# EAGLE design DIDV_-_Controle_Corrente_Total (EAGLE 6.2)

## Sheet 1 of 5
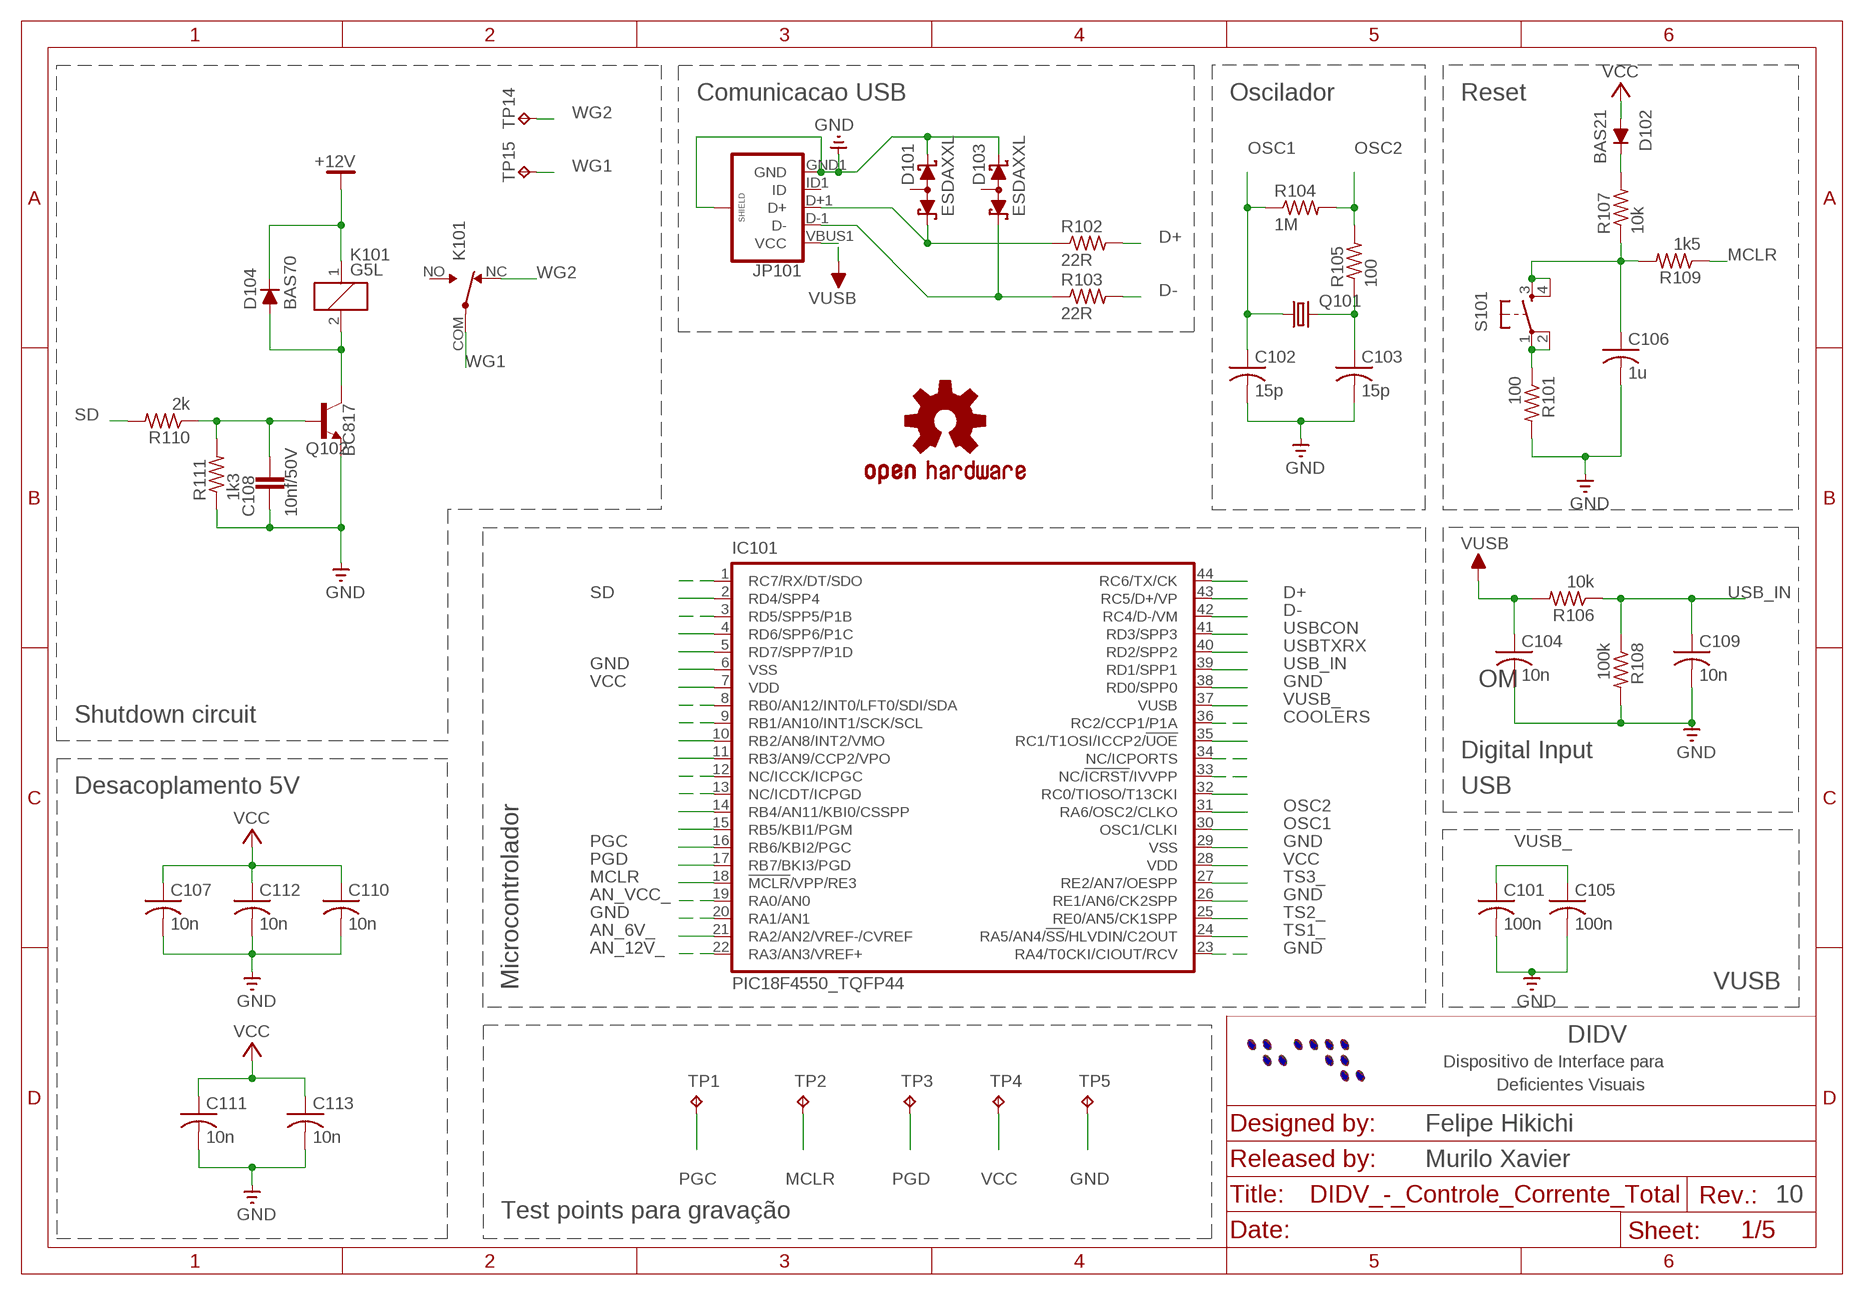
[diagram p0: schematic, sheet 1]

### Parts
C101  100n  C-USC0603  [C0603]
C102  15p  C-USC0603K  [C0603K]
C103  15p  C-USC0603K  [C0603K]
C104  10n  C-USC0805K  [C0805K]
C105  100n  C-USC0603  [C0603]
C106  1u  C-USC0805K  [C0805K]
C107  10n  C-USC0603  [C0603]
C108  10nf/50V  C-EUC0603K  [C0603K]
C109  10n  C-USC0603K  [C0603K]
C110  10n  C-USC0805K  [C0805K]
C111  10n  C-USC0805K  [C0805K]
C112  10n  C-USC0603  [C0603]
C113  10n  C-USC0805K  [C0805K]
D101  ESDAXXL  [SOT23]
D102  BAS21  BAS19  [SOT23]
D103  ESDAXXL  [SOT23]
D104  BAS70  BAS40  [SOT23]
IC101  PIC18F4550_TQFP44  PIC18F4550_TQFP  [TQFP44]
JP101  USB_MICROB_PLUGCONN-11752  [USB-B-MICRO-SMD_V03]
K101  G5L  [G5LE]
LOGO101  OSHW-LOGOL  [OSHW-LOGO-L]
Q101  CRYSTALSM49  [SM49]
Q102  BC817  BC817-16LT1SMD  [SOT23-BEC]
R101  100  R-US_R0603  [R0603]
R102  22R  R-US_R0603  [R0603]
R103  22R  R-US_R0603  [R0603]
R104  1M  R-US_R0603  [R0603]
R105  100  R-US_R0603  [R0603]
R106  10k  R-US_R0603  [R0603]
R107  10k  R-US_R0603  [R0603]
R108  100k  R-US_R0603  [R0603]
R109  1k5  R-US_R0603  [R0603]
R110  2k  R-US_R0603  [R0603]
R111  1k3  R-US_R0603  [R0603]
S101  TAC_SWITCHPTH  [TACTILE-PTH]
TP1  TPB1,27  [B1,27]
TP2  TPB1,27  [B1,27]
TP3  TPB1,27  [B1,27]
TP4  TPB1,27  [B1,27]
TP5  TPB1,27  [B1,27]
TP14  TP-063  [TP-063]
TP15  TP-063  [TP-063]

### Nets
+12V: D104.3(C) K101.1 ; also sheet 2,3,5
AN_6V_: IC101.21(RA2/AN2/VREF-/CVREF) ; also sheet 3
AN_12V_: IC101.22(RA3/AN3/VREF+) ; also sheet 3
AN_VCC_: IC101.19(RA0/AN0) ; also sheet 3
COOLERS: IC101.36(RC2/CCP1/P1A) ; also sheet 5
D+: IC101.43(RC5/D+/VP) R102.2
D-: IC101.42(RC4/D-/VM) R103.2
GND: C101.2 C102.2 C103.2 C104.2 C105.2 C106.2 C107.2 C108.2 C109.2 C110.2 C111.2 C112.2 C113.2 D101.2(C2) D103.2(C2) IC101.6(VSS) IC101.20(RA1/AN1) IC101.23(RA4/T0CKI/CIOUT/RCV) IC101.26(RE1/AN6/CK2SPP) IC101.29(VSS) IC101.38(RD0/SPP0) JP101.GND1(GND) JP101.SHIELD1(SHIELD) JP101.SHIELD2(SHIELD) JP101.SHIELD3(SHIELD) Q102.E R101.2 R108.2 R111.1 TP5.TP ; also sheet 2,3,4,5
MCLR: IC101.18(!MCLR!/VPP/RE3) R109.1 TP2.TP
N$3: C103.1 Q101.2 R105.1
N$11: D102.3(C) R107.2
N$16: IC101.4(RD6/SPP6/P1C)
N$17: IC101.14(RB4/AN11/KBI0/CSSPP)
N$18: IC101.15(RB5/KBI1/PGM)
N$19: IC101.35(RC1/T1OSI/ICCP2/!UOE)
N$22: IC101.44(RC6/TX/CK)
N$23: IC101.32(RC0/TIOSO/T13CKI)
N$24: IC101.11(RB3/AN9/CCP2/VPO)
N$26: IC101.5(RD7/SPP7/P1D)
N$28: D104.1(A) K101.2 Q102.C
N$29: C108.1 Q102.B R110.1 R111.2
N$33: D103.1(C1) JP101.D-1(D-) R103.1
N$35: IC101.13(NC/ICDT/ICPGD)
N$36: IC101.12(NC/ICCK/ICPGC)
N$37: D101.1(C1) JP101.D+1(D+) R102.1
N$38: IC101.9(RB1/AN10/INT1/SCK/SCL)
N$39: IC101.8(RB0/AN12/INT0/LFT0/SDI/SDA)
N$40: IC101.3(RD5/SPP5/P1B)
N$41: IC101.1(RC7/RX/DT/SDO)
N$43: IC101.34(NC/ICPORTS)
N$44: IC101.33(NC/!ICRST!/IVVPP)
N$45: R101.1 S101.1 S101.2
N$68: IC101.10(RB2/AN8/INT2/VMO)
OSC1: C102.1 IC101.30(OSC1/CLKI) Q101.1 R104.1
OSC2: IC101.31(RA6/OSC2/CLKO) R104.2 R105.2
PGC: IC101.16(RB6/KBI2/PGC) TP1.TP
PGD: IC101.17(RB7/BKI3/PGD) TP3.TP
SD: IC101.2(RD4/SPP4) R110.2
TS1_: IC101.24(RA5/AN4/!SS!/HLVDIN/C2OUT) ; also sheet 4
TS2_: IC101.25(RE0/AN5/CK1SPP) ; also sheet 4
TS3_: IC101.27(RE2/AN7/OESPP) ; also sheet 4
U_MCLR: C106.1 R107.1 R109.2 S101.3 S101.4
USB_IN: C109.1 IC101.39(RD1/SPP1) R106.1 R108.1
USBCON: IC101.41(RD3/SPP3) ; also sheet 2
USBTXRX: IC101.40(RD2/SPP2) ; also sheet 2
VCC: C107.1 C110.1 C111.1 C112.1 C113.1 D102.1(A) IC101.7(VDD) IC101.28(VDD) TP4.TP ; also sheet 2,3,4
VUSB: C104.1 JP101.VBUS1(VCC) R106.2
VUSB_: C101.1 C105.1 IC101.37(VUSB)
WG1: K101.COM(-A:COM) TP15.1
WG2: K101.NC(-A:NC) TP14.1
Unconnected: D101.3(A) D103.3(A) JP101.ID1(ID) K101.NO(-A:NO)

### Notes on the sheet
- Comunicacao USB | Oscilador | Reset
- OM
- Shutdown circuit
- Digital Input
- Desacoplamento 5V | USB
- VUSB
- Microcontrolador
- DIDV
- Dispositivo de Interface para
- Deficientes Visuais
- Felipe Hikichi
- Murilo Xavier
- 10
- Test points para gravação

## Sheet 2 of 5
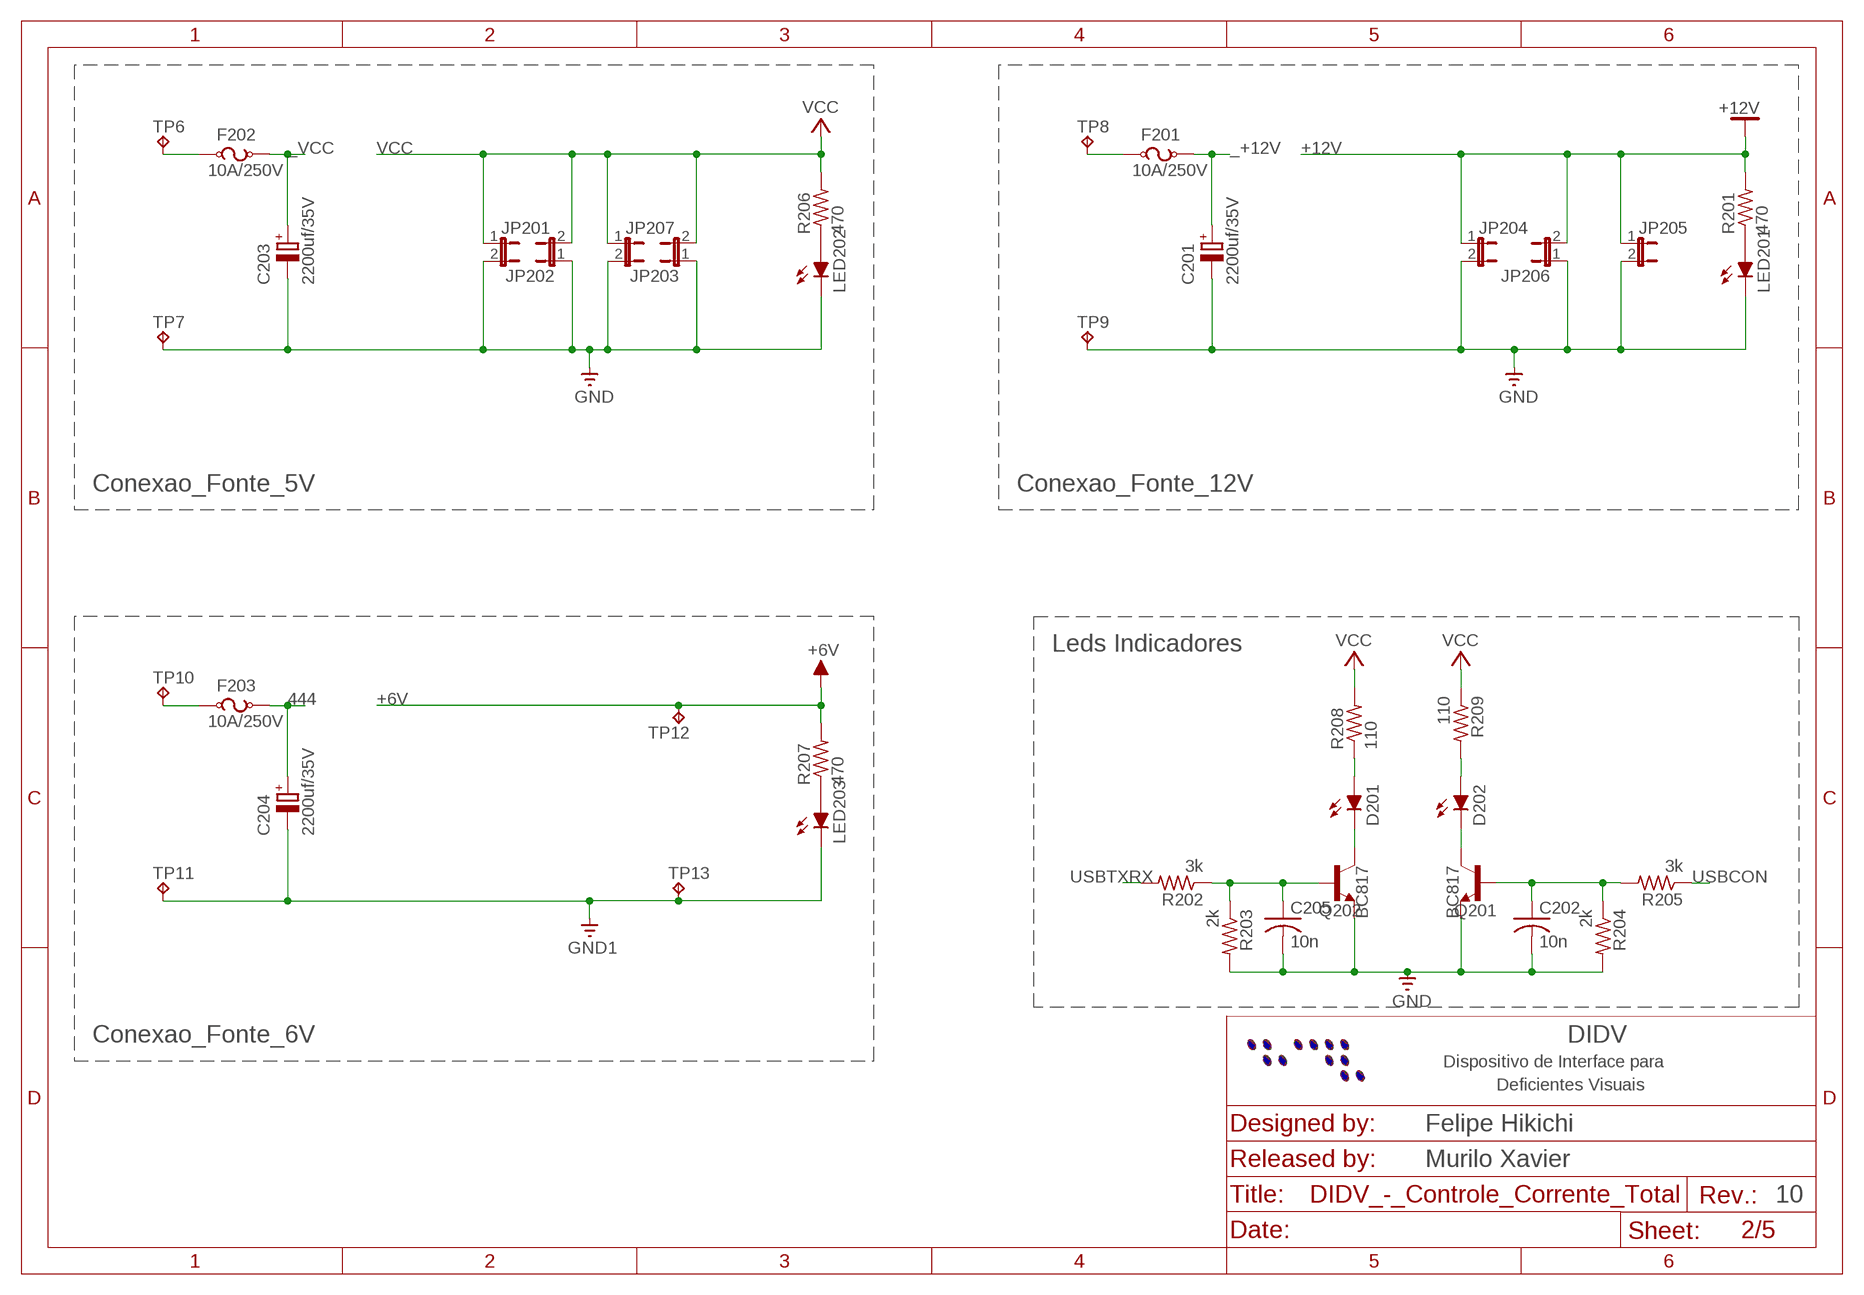
[diagram p1: schematic, sheet 2]

### Parts
C201  2200uf/35V  CPOL-EUE3.5-10  [E3,5-10]
C202  10n  C-USC0603  [C0603]
C203  2200uf/35V  CPOL-EUE3.5-10  [E3,5-10]
C204  2200uf/35V  CPOL-EUE3.5-10  [E3,5-10]
C205  10n  C-USC0603  [C0603]
D201  LEDTOPLED-SANTANA  [MINI-TOPLED-SANTANA]
D202  LEDTOPLED-SANTANA  [MINI-TOPLED-SANTANA]
F201  10A/250V  KS9V  [KS9V]
F202  10A/250V  KS9V  [KS9V]
F203  10A/250V  KS9V  [KS9V]
JP201  JP1EY  [JP1Y]
JP202  JP1EY  [JP1Y]
JP203  JP1EY  [JP1Y]
JP204  JP1EY  [JP1Y]
JP205  JP1EY  [JP1Y]
JP206  JP1EY  [JP1Y]
JP207  JP1EY  [JP1Y]
LED201  LEDP-LCC-2  [P-LCC-2]
LED202  LEDP-LCC-2  [P-LCC-2]
LED203  LEDP-LCC-2  [P-LCC-2]
Q201  BC817  BC817-16LT1SMD  [SOT23-BEC]
Q202  BC817  BC817-16LT1SMD  [SOT23-BEC]
R201  470  R-US_R1206  [R1206]
R202  3k  R-US_R0603  [R0603]
R203  2k  R-US_R0603  [R0603]
R204  2k  R-US_R0603  [R0603]
R205  3k  R-US_R0603  [R0603]
R206  470  R-US_R1206  [R1206]
R207  470  R-US_R1206  [R1206]
R208  110  R-US_R1206  [R1206]
R209  110  R-US_R1206  [R1206]
TP6  TP-063  [TP-063]
TP7  TP-063  [TP-063]
TP8  TP-063  [TP-063]
TP9  TP-063  [TP-063]
TP10  TP-063  [TP-063]
TP11  TP-063  [TP-063]
TP12  TP-063  [TP-063]
TP13  TP-063  [TP-063]

### Nets
444: C204.+ F203.2 ; also sheet 3
+6V: R207.2 TP12.1 ; also sheet 3
+12V: JP204.1 JP205.1 JP206.2 R201.2 ; also sheet 1,3,5
_+12V: C201.+ F201.2 ; also sheet 3
_VCC: C203.+ F202.2 ; also sheet 3
GND: C201.- C202.2 C203.- C205.2 JP201.2 JP202.1 JP203.1 JP204.2 JP205.2 JP206.1 JP207.2 LED201.C LED202.C Q201.E Q202.E R203.2 R204.2 TP7.1 TP9.1 ; also sheet 1,3,4,5
GND1: C204.- LED203.C TP11.1 TP13.1
N$1: LED202.A R206.1
N$4: LED201.A R201.1
N$5: F201.1 TP8.1
N$7: LED203.A R207.1
N$8: F203.1 TP10.1
N$9: D201.A R208.1
N$10: D202.A R209.2
N$13: C205.1 Q202.B R202.1 R203.1
N$15: C202.1 Q201.B R204.1 R205.2
N$30: D201.C Q202.C
N$31: D202.C Q201.C
N$46: F202.1 TP6.1
USBCON: R205.1 ; also sheet 1
USBTXRX: R202.2 ; also sheet 1
VCC: JP201.1 JP202.2 JP203.2 JP207.1 R206.2 R208.2 R209.1 ; also sheet 1,3,4

### Notes on the sheet
- Conexao_Fonte_5V | Conexao_Fonte_12V
- Leds Indicadores
- Conexao_Fonte_6V | DIDV
- Dispositivo de Interface para
- Deficientes Visuais
- Felipe Hikichi
- Murilo Xavier
- 10

## Sheet 3 of 5
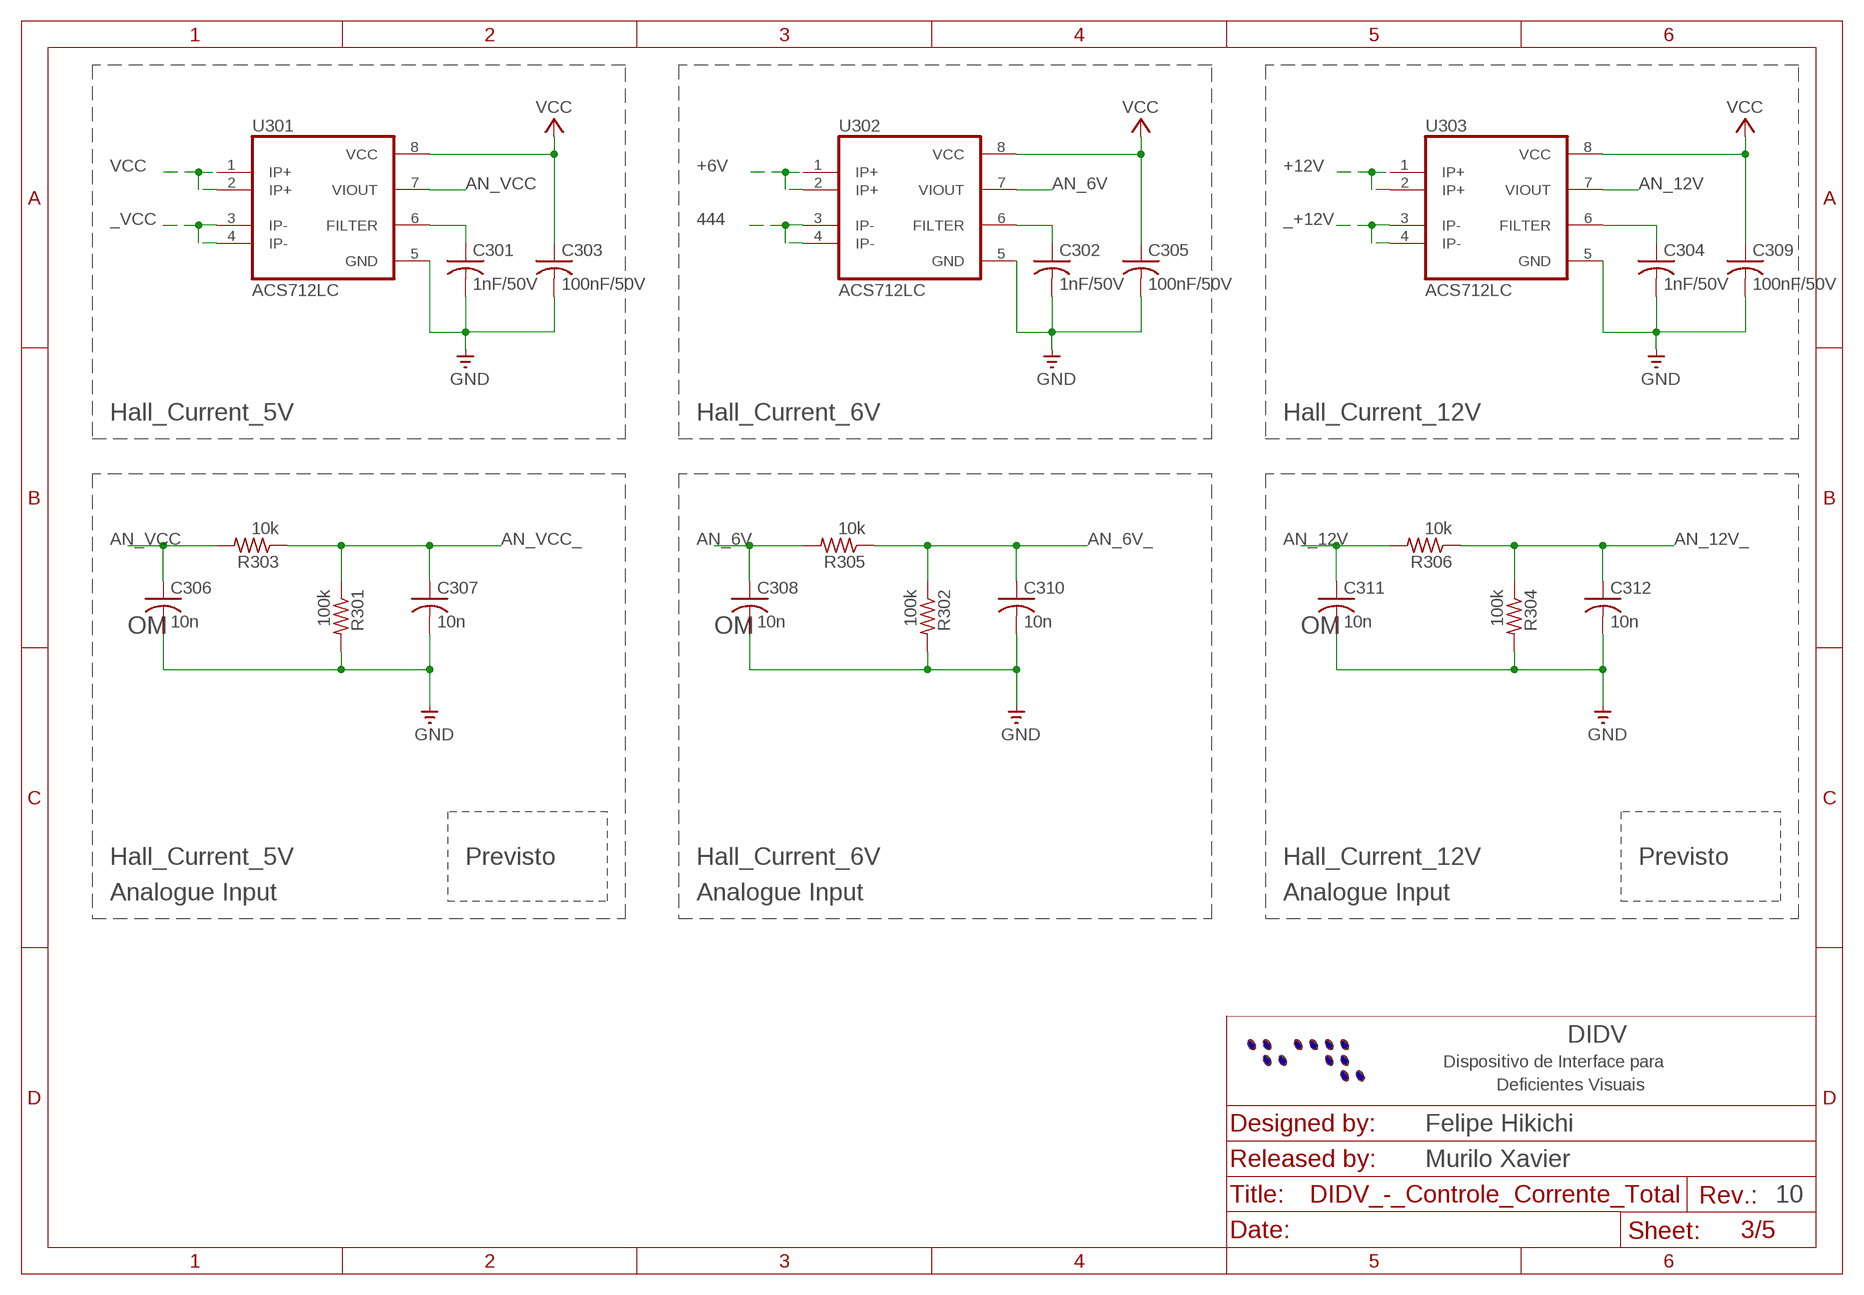
[diagram p2: schematic, sheet 3]

### Parts
C301  1nF/50V  C-USC0603  [C0603]
C302  1nF/50V  C-USC0603  [C0603]
C303  100nF/50V  C-USC0805  [C0805]
C304  1nF/50V  C-USC0603  [C0603]
C305  100nF/50V  C-USC0805  [C0805]
C306  10n  C-USC0805K  [C0805K]
C307  10n  C-USC0603K  [C0603K]
C308  10n  C-USC0805K  [C0805K]
C309  100nF/50V  C-USC0805  [C0805]
C310  10n  C-USC0603K  [C0603K]
C311  10n  C-USC0805K  [C0805K]
C312  10n  C-USC0603K  [C0603K]
R301  100k  R-US_R0603  [R0603]
R302  100k  R-US_R0603  [R0603]
R303  10k  R-US_R0603  [R0603]
R304  100k  R-US_R0603  [R0603]
R305  10k  R-US_R0603  [R0603]
R306  10k  R-US_R0603  [R0603]
U301  ACS712LC  [SO08]
U302  ACS712LC  [SO08]
U303  ACS712LC  [SO08]

### Nets
444: U302.3(IP-) U302.4(IP-) ; also sheet 2
+6V: U302.1(IP+) U302.2(IP+) ; also sheet 2
+12V: U303.1(IP+) U303.2(IP+) ; also sheet 1,2,5
_+12V: U303.3(IP-) U303.4(IP-) ; also sheet 2
_VCC: U301.3(IP-) U301.4(IP-) ; also sheet 2
AN_6V: C308.1 R305.2 U302.7(VIOUT)
AN_6V_: C310.1 R302.1 R305.1 ; also sheet 1
AN_12V: C311.1 R306.2 U303.7(VIOUT)
AN_12V_: C312.1 R304.1 R306.1 ; also sheet 1
AN_VCC: C306.1 R303.2 U301.7(VIOUT)
AN_VCC_: C307.1 R301.1 R303.1 ; also sheet 1
GND: C301.2 C302.2 C303.2 C304.2 C305.2 C306.2 C307.2 C308.2 C309.2 C310.2 C311.2 C312.2 R301.2 R302.2 R304.2 U301.5(GND) U302.5(GND) U303.5(GND) ; also sheet 1,2,4,5
N$2: C302.1 U302.6(FILTER)
N$6: C304.1 U303.6(FILTER)
N$12: C301.1 U301.6(FILTER)
VCC: C303.1 C305.1 C309.1 U301.1(IP+) U301.2(IP+) U301.8(VCC) U302.8(VCC) U303.8(VCC) ; also sheet 1,2,4

### Notes on the sheet
- Hall_Current_5V | Hall_Current_6V | Hall_Current_12V
- OM | OM | OM
- Hall_Current_5V | Previsto | Hall_Current_6V | Hall_Current_12V | Previsto
- Analogue Input | Analogue Input | Analogue Input
- DIDV
- Dispositivo de Interface para
- Deficientes Visuais
- Felipe Hikichi
- Murilo Xavier
- 10

## Sheet 4 of 5
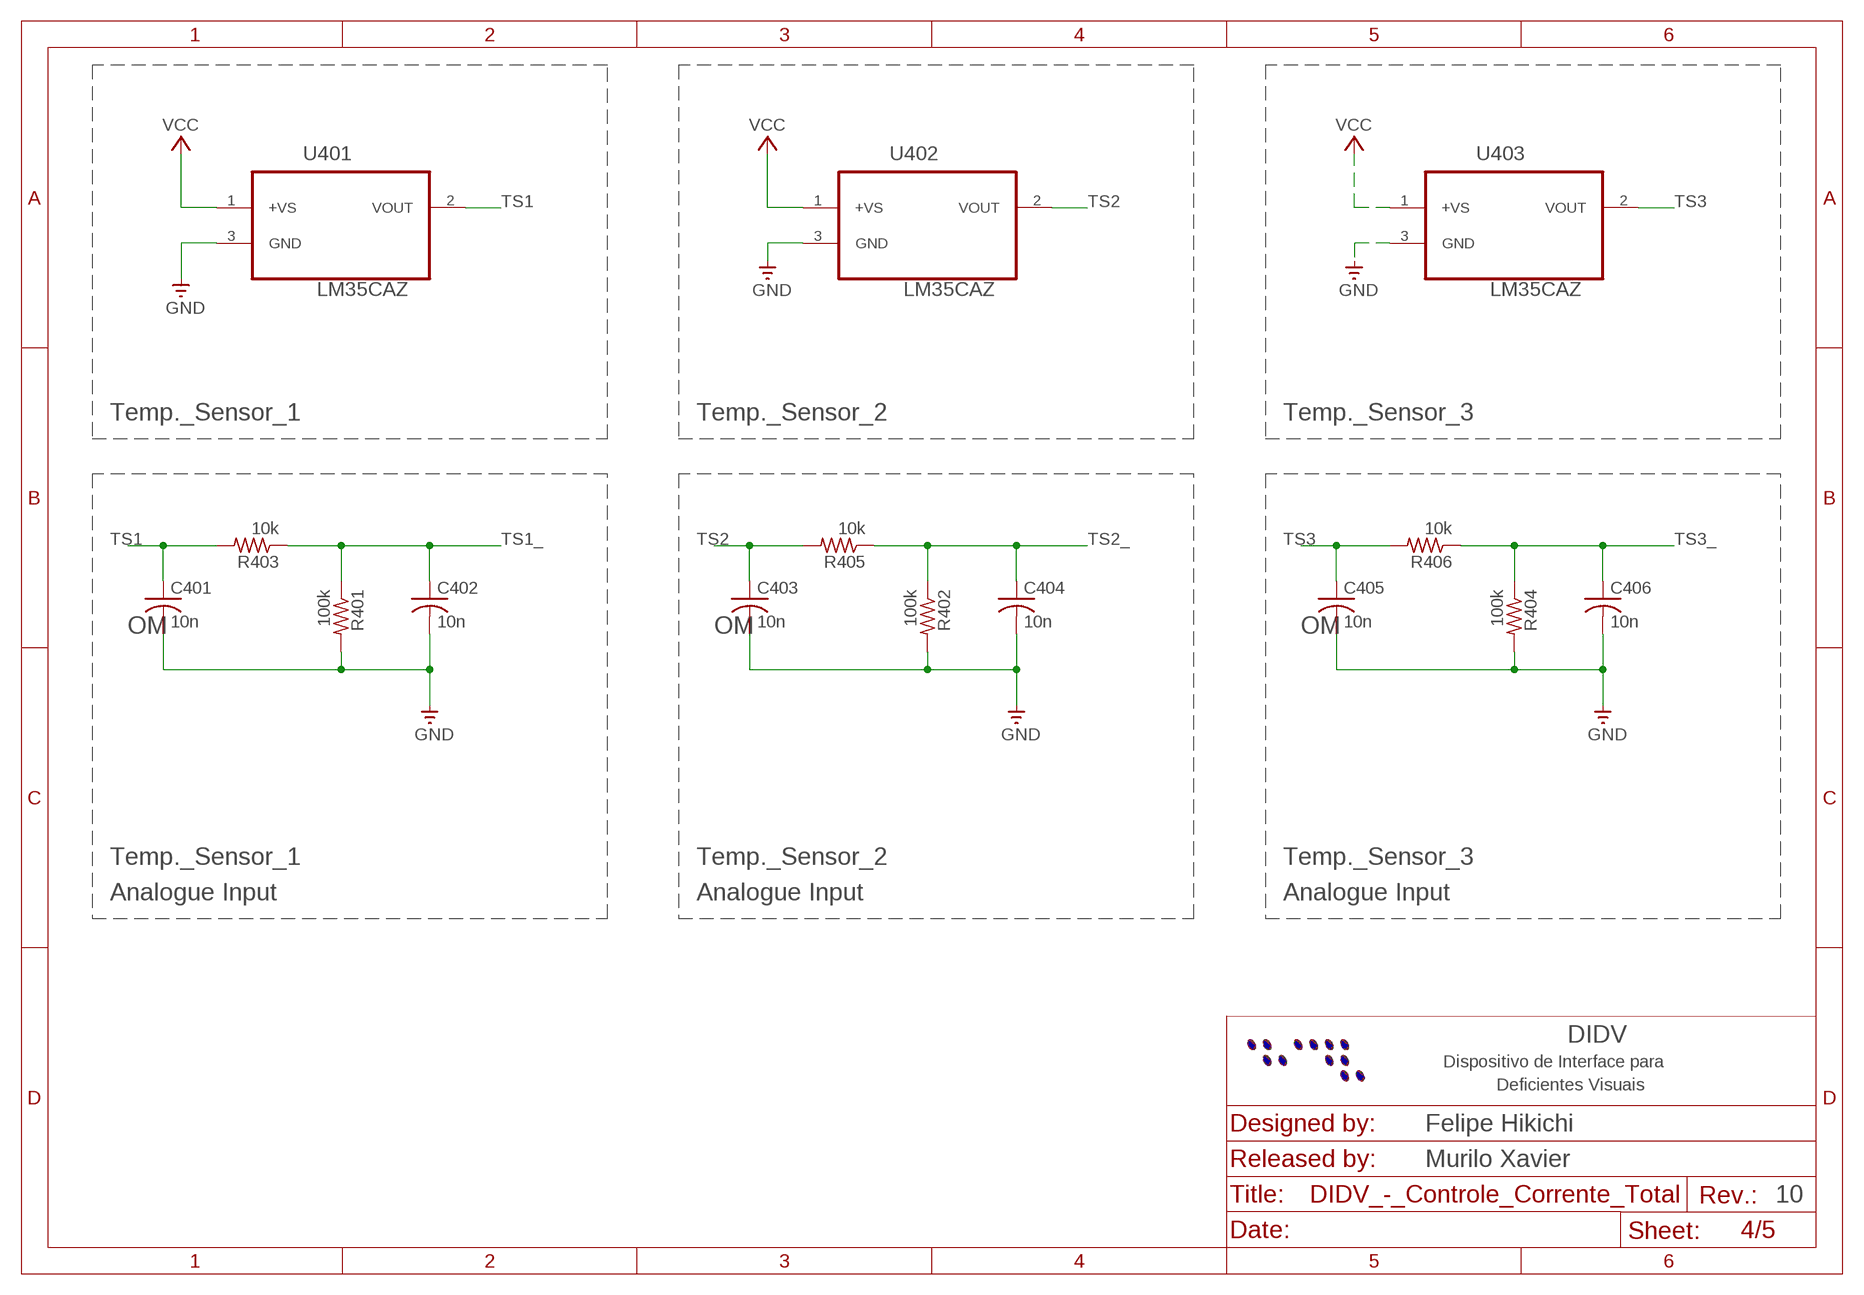
[diagram p3: schematic, sheet 4]

### Parts
C401  10n  C-USC0805K  [C0805K]
C402  10n  C-USC0603K  [C0603K]
C403  10n  C-USC0805K  [C0805K]
C404  10n  C-USC0603K  [C0603K]
C405  10n  C-USC0805K  [C0805K]
C406  10n  C-USC0603K  [C0603K]
R401  100k  R-US_R0603  [R0603]
R402  100k  R-US_R0603  [R0603]
R403  10k  R-US_R0603  [R0603]
R404  100k  R-US_R0603  [R0603]
R405  10k  R-US_R0603  [R0603]
R406  10k  R-US_R0603  [R0603]
U401  LM35CAZ  [TO127P254X495-3P]
U402  LM35CAZ  [TO127P254X495-3P]
U403  LM35CAZ  [TO127P254X495-3P]

### Nets
GND: C401.2 C402.2 C403.2 C404.2 C405.2 C406.2 R401.2 R402.2 R404.2 U401.3(GND) U402.3(GND) U403.3(GND) ; also sheet 1,2,3,5
TS1: C401.1 R403.2 U401.2(VOUT)
TS1_: C402.1 R401.1 R403.1 ; also sheet 1
TS2: C403.1 R405.2 U402.2(VOUT)
TS2_: C404.1 R402.1 R405.1 ; also sheet 1
TS3: C405.1 R406.2 U403.2(VOUT)
TS3_: C406.1 R404.1 R406.1 ; also sheet 1
VCC: U401.1(+VS) U402.1(+VS) U403.1(+VS) ; also sheet 1,2,3

### Notes on the sheet
- Temp._Sensor_1 | Temp._Sensor_2 | Temp._Sensor_3
- OM | OM | OM
- Temp._Sensor_1 | Temp._Sensor_2 | Temp._Sensor_3
- Analogue Input | Analogue Input | Analogue Input
- DIDV
- Dispositivo de Interface para
- Deficientes Visuais
- Felipe Hikichi
- Murilo Xavier
- 10

## Sheet 5 of 5
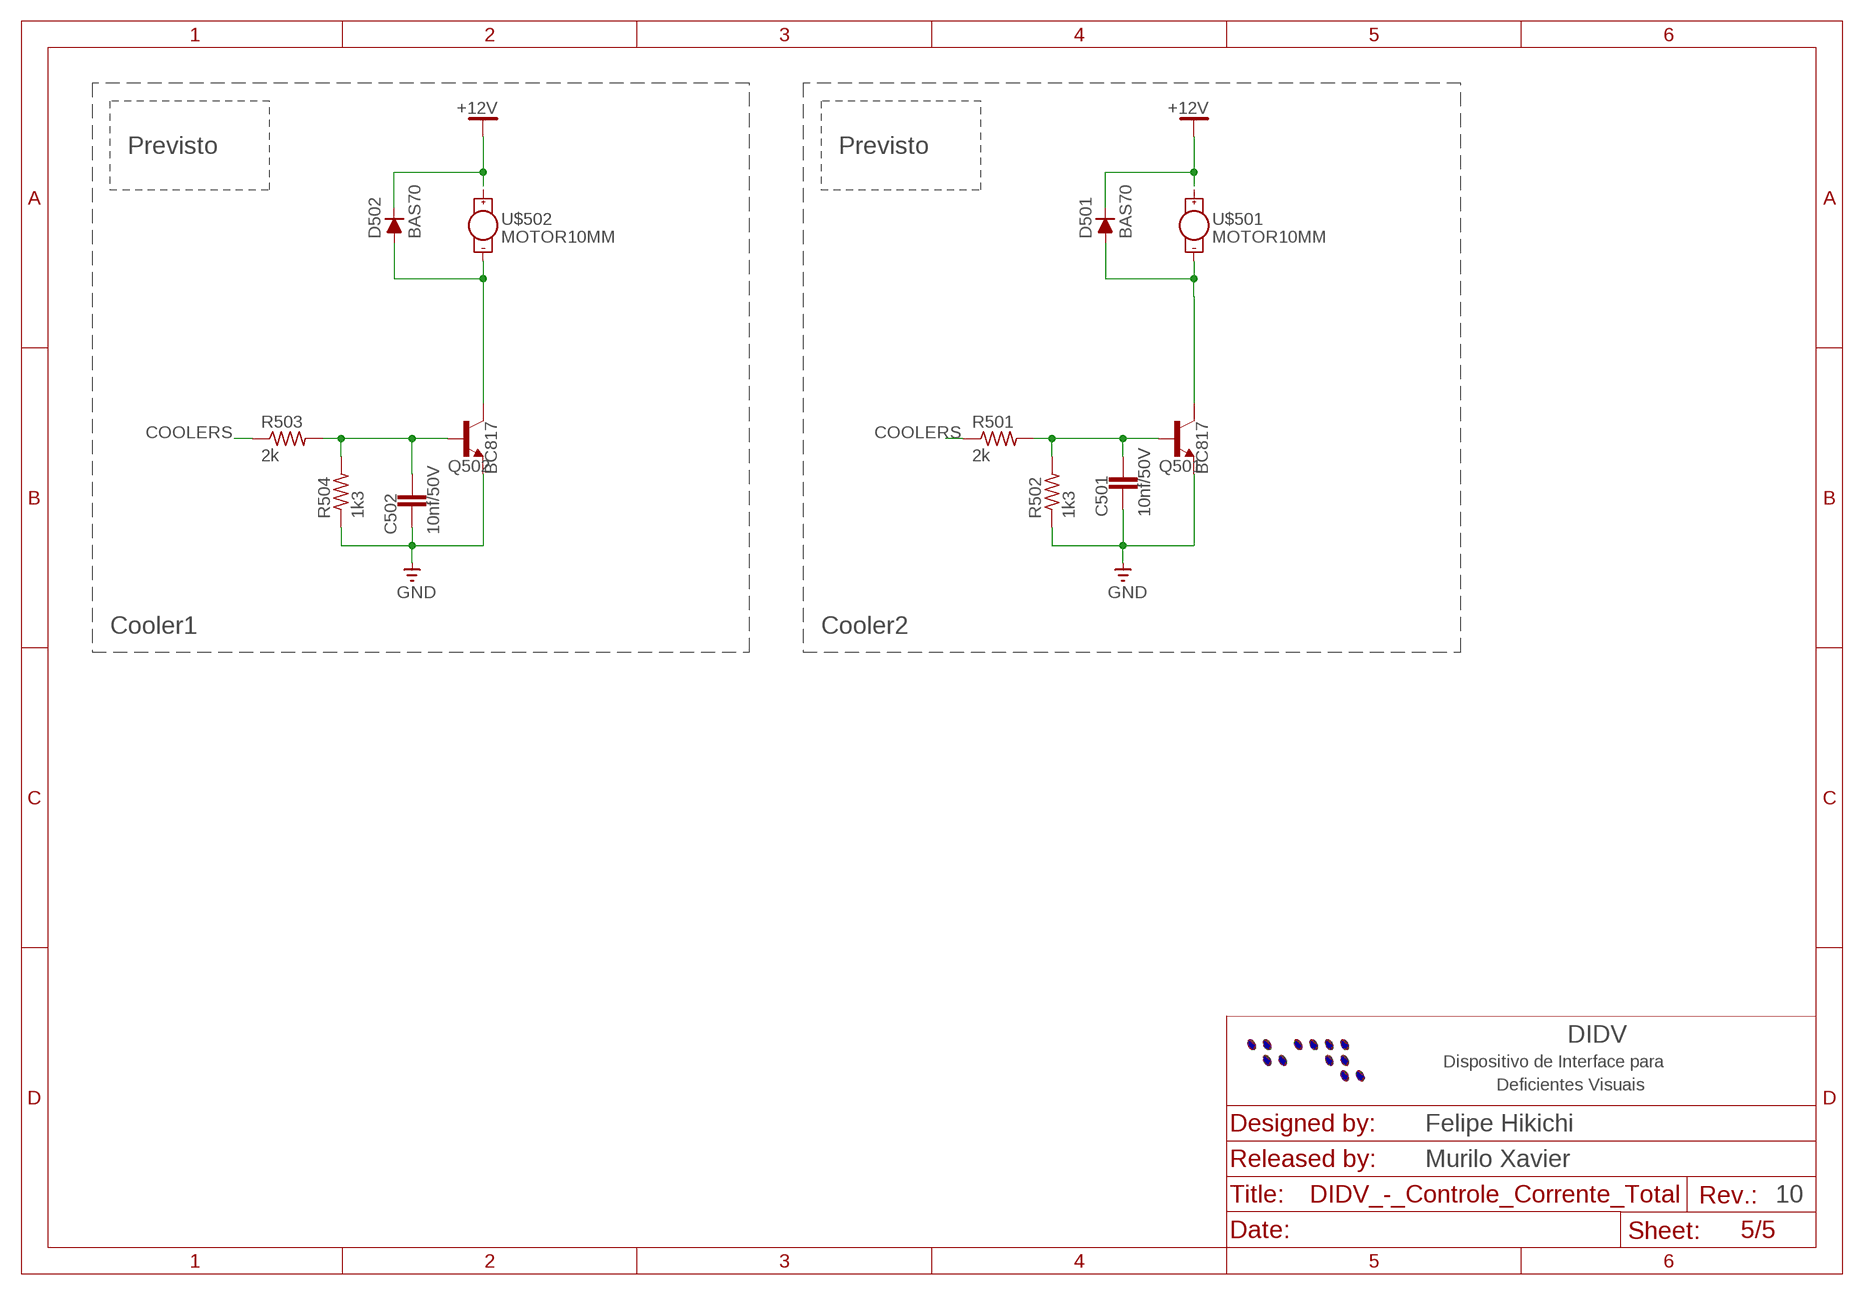
[diagram p4: schematic, sheet 5]

### Parts
C501  10nf/50V  C-EUC0603K  [C0603K]
C502  10nf/50V  C-EUC0603K  [C0603K]
D501  BAS70  BAS40  [SOT23]
D502  BAS70  BAS40  [SOT23]
Q501  BC817  BC817-16LT1SMD  [SOT23-BEC]
Q502  BC817  BC817-16LT1SMD  [SOT23-BEC]
R501  2k  R-US_R0603  [R0603]
R502  1k3  R-US_R0603  [R0603]
R503  2k  R-US_R0603  [R0603]
R504  1k3  R-US_R0603  [R0603]
U$501  MOTOR10MM  [VIBE-MOTOR-10MM]
U$502  MOTOR10MM  [VIBE-MOTOR-10MM]

### Nets
+12V: D501.3(C) D502.3(C) U$501.+ U$502.+ ; also sheet 1,2,3
COOLERS: R501.1 R503.1 ; also sheet 1
GND: C501.2 C502.2 Q501.E Q502.E R502.1 R504.1 ; also sheet 1,2,3,4
N$14: C501.1 Q501.B R501.2 R502.2
N$21: D501.1(A) Q501.C U$501.-
N$70: C502.1 Q502.B R503.2 R504.2
N$71: D502.1(A) Q502.C U$502.-

### Notes on the sheet
- Previsto | Previsto
- Cooler1 | Cooler2
- DIDV
- Dispositivo de Interface para
- Deficientes Visuais
- Felipe Hikichi
- Murilo Xavier
- 10

## Library data of the parts
C101-C107 C109-C113 C202 C205 C301-C312 C401-C406 = rcl:C-US: CAPACITOR, American symbol
C108 C501 C502 = rcl:C-EU: CAPACITOR, European symbol
C201 C203 C204 = rcl:CPOL-EU: POLARIZED CAPACITOR, European symbol
D101 D103 = diode:ESDAXXL: DUAL TRANSIL ARRAY
D102 = diode:BAS19: DIODE switching
D104 D501 D502 = diode:BAS40: Schottky Barrier Diode 40V General-purpose diode for high-speed switching
D201 D202 LED201-LED203 = led:LED: LED Various Types
F201-F203 = fuse:KS9V: FUSE HOLDER CS, Schukat
IC101 = microchip:PIC18F4*_TQFP: USB Microcontrollers with nanoWatt Technology High-Performance, Enhanced Flash, 28/40/44-Pin, Source: http://ww1.microchip.com/downloads/en/devicedoc/39632c.pdf
JP101 = SparkFun-Connectors:USB_MICROB_PLUG: USB Micro-B connectors Some male, some female. Watch your step!; PROD_ID: CONN-11752
JP201-JP207 = jumper:JP1E: JUMPER
K101 = relay:G5L: RELAY 1 x switch, 10 A/120 V AC, 8 A/30 V ADC, Omron
LOGO101 = OpenHW_BOT:OSHW-LOGO: Open Source Hardware Logo This logo indicates the piece of hardware it is found on incorporates a OSHW license and/or adheres to the definition of open source hardware found here: http://freedomdefined.org/OSHW
Q101 = crystal:CRYSTAL: CRYSTAL; OC_FARNELL: unknown; OC_NEWARK: unknown
Q102 Q201 Q202 Q501 Q502 = transistor-npn:BC817*: NPN Transistor
R101-R111 R201-R209 R301-R306 R401-R406 R501-R504 = rcl:R-US_: RESISTOR, American symbol
S101 = SparkFun-Electromechanical:TAC_SWITCH: Momentary Switch Button commonly used for reset or general input. Spark Fun Electronics SKU : COM-00097 SMT- SWCH-08247
TP1-TP5 = testpad:TP: Test pad
TP6-TP9 TP12-TP15 = keystone:TP: TEST POINT PCB Vertical Mount
TP10 TP11 = keystone_Gordo:TP: TEST POINT PCB Vertical Mount
U301-U303 = allegro-micro:ACS712: Linear Current Sensor Fully Integrated, Hall Effect-Based 2.1 kVRMS Voltage Isolation and a Low-Resistance Current Conductor
U401-U403 = NSC_By_element14_Batch_1.1:LM35CAZ: IC, TEMPERATURE SENSOR, ± 0.2°C; MPN: LM35CAZ; OC_FARNELL: 9494529; OC_NEWARK: 41K4844; PACKAGE: TO-92; SUPPLIER: NationalSemiconductor
U$501 U$502 = SparkFun-Electromechanical:MOTOR: Vibration Motor- ROB-08449 Physical dimension and wire connections for this powerful vibration motor. Motor has a self adhesive backing.

## Board
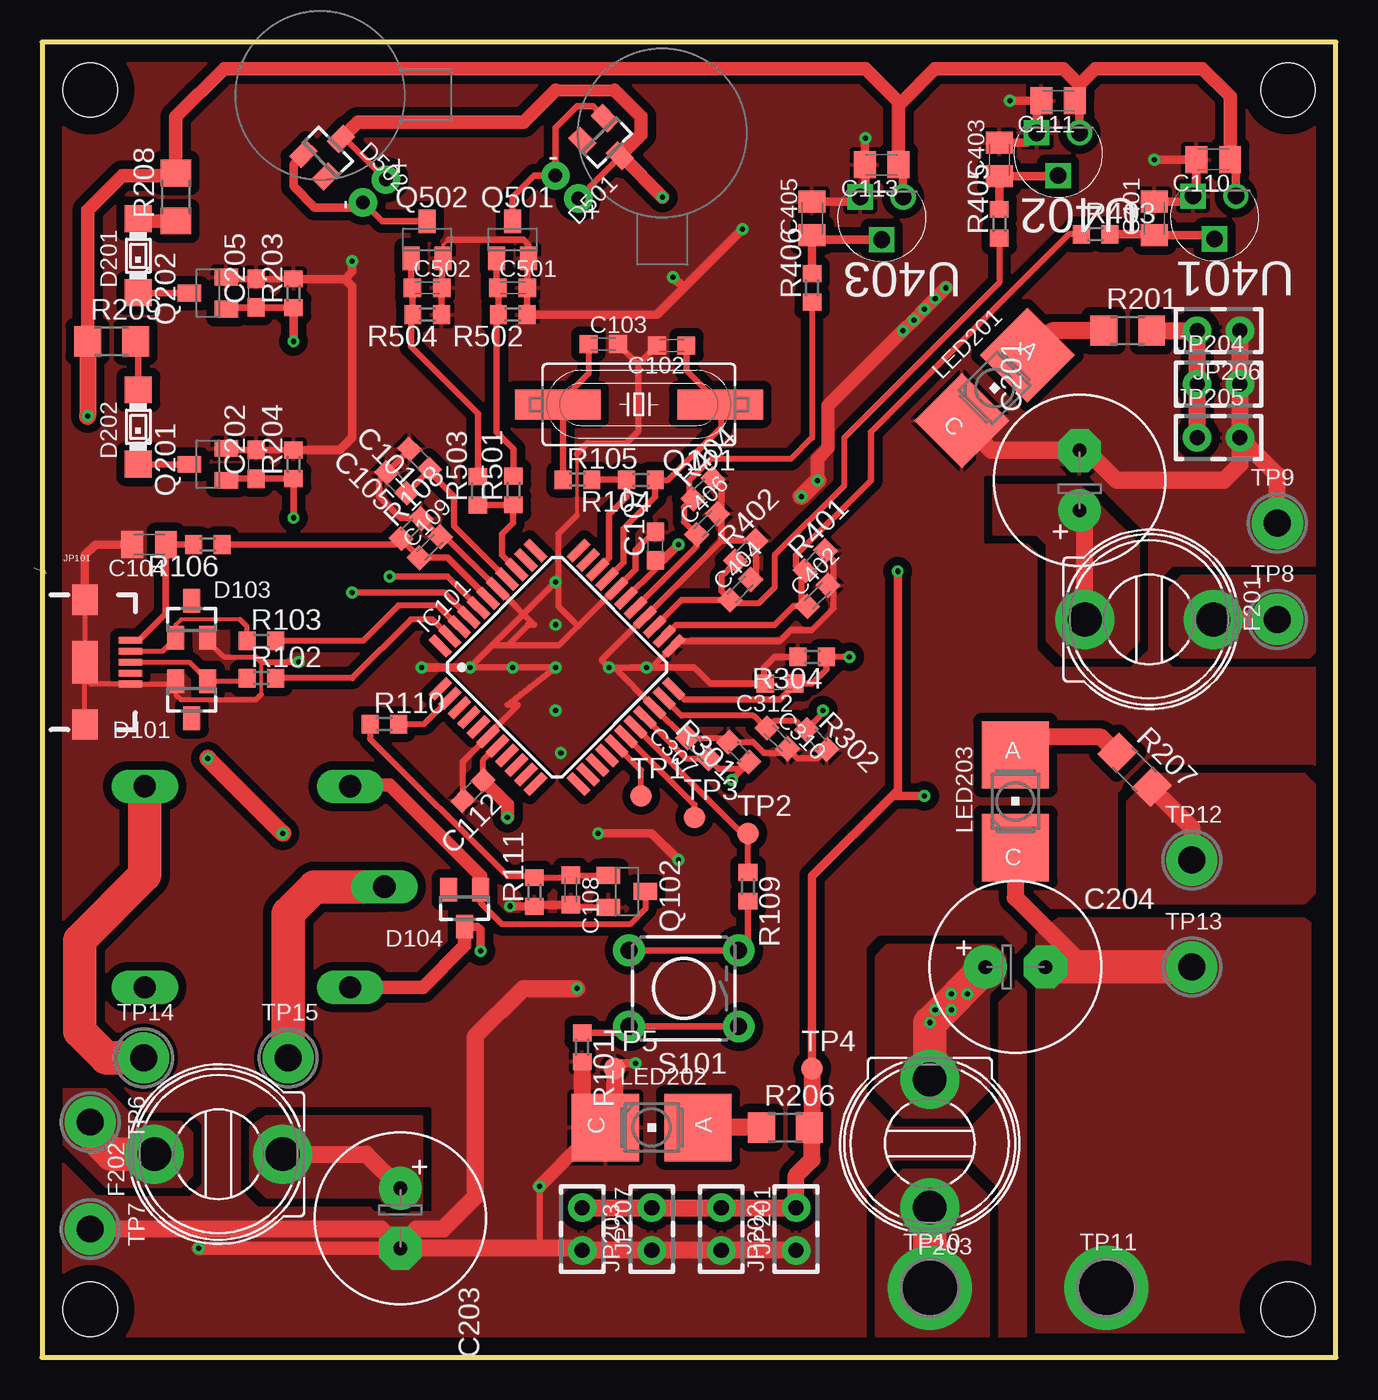
[diagram p5: board, top side]
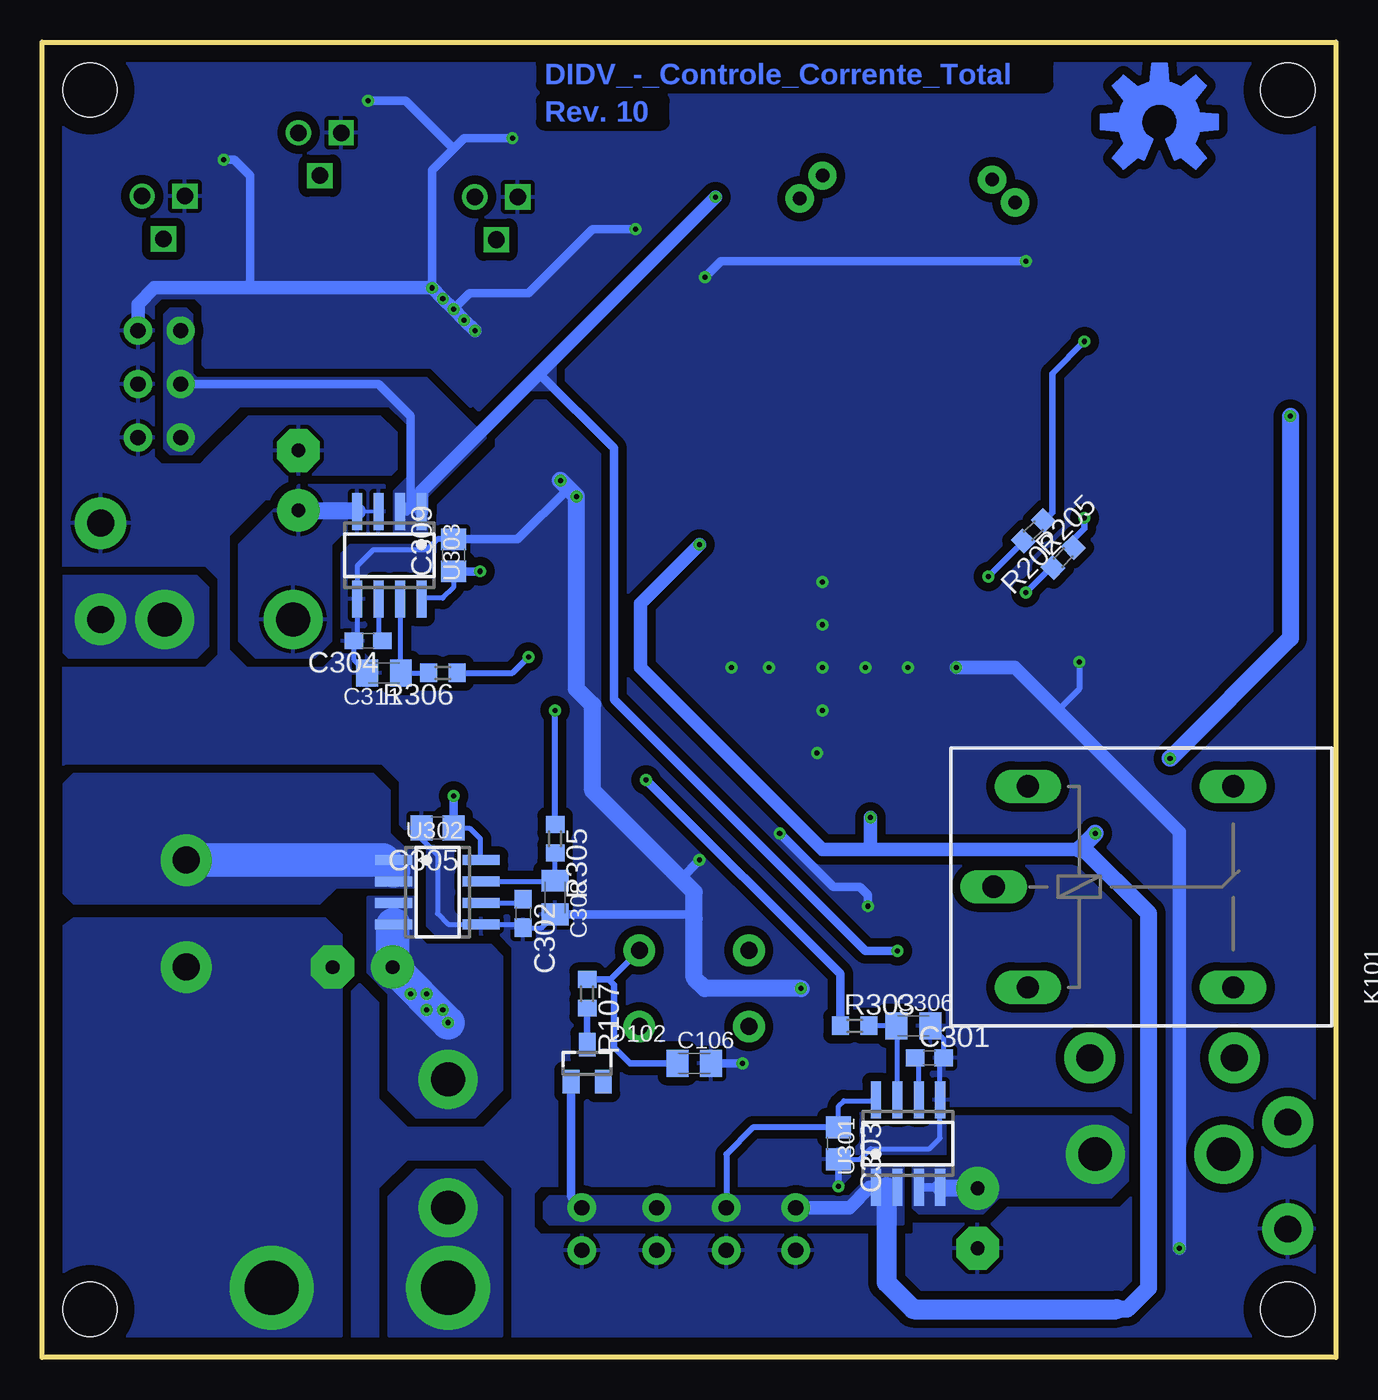
[diagram p6: board, bottom side, seen from below]

Size 76.81 x 78.09 mm. Coordinates in mm from the lower left corner, seen from the top.
Outline: 0,0 76.81,0 76.81,78.09 0,78.09 0,0
Copper layers (1*16): Top 0.035mm / dielectric 1.5mm / Bottom 0.035mm
Design rules: minimum track width 10mil, minimum drill 24mil, track to track 8mil, track to pad 8mil, pad to pad 8mil, via to via 8mil, smd to smd 8mil, copper to edge 40mil, drill to drill 8mil, minimum pad ring 10mil, minimum via ring 8mil, stop-mask expansion 4mil, vias tented up to drill 0mil, thermal gap 10mil
Holes 3.2 mm at 2.86,75.25 73.98,75.25 73.98,2.86 2.86,2.86

### Footprints (pad centres in the part's own frame; a part is rotated, then mirrored left to right if it is on the bottom)
C0603 = smd 1.1 x 1: 1 -0.85,0; 2 0.85,0
C0603K = smd 1.05 x 1.08: 1 -0.875,0; 2 0.875,0
C0805K = smd 1.3 x 1.6: 1 -1,0; 2 1,0
E3,5-10 = drill 0.813 pad 2.54: + -1.778,0 | drill 0.813 pad 2.54 octagon: - 1.778,0
C0805 = smd 1.3 x 1.5: 1 -0.95,0; 2 0.95,0
SOT23 = smd 1 x 1.4: 1 -0.95,-1.1; 2 0.95,-1.1; 3 0,1.1
MINI-TOPLED-SANTANA = smd 1.6 x 1.6: A 0,2.2; C 0,-2.2
KS9V = drill 2 pad 3.5: 1 0,3.81; 2 0,-3.81
TQFP44 = smd 1.5 x 0.5: 1 -5.8,4; 2 -5.8,3.2; 3 -5.8,2.4; 4 -5.8,1.6; 5 -5.8,0.8; 6 -5.8,0; 7 -5.8,-0.8; 8 -5.8,-1.6; 9 -5.8,-2.4; 10 -5.8,-3.2; 11 -5.8,-4; 23 5.8,-4; 24 5.8,-3.2; 25 5.8,-2.4; 26 5.8,-1.6; 27 5.8,-0.8; 28 5.8,0; 29 5.8,0.8; 30 5.8,1.6; 31 5.8,2.4; 32 5.8,3.2; 33 5.8,4 | smd 0.5 x 1.5: 12 -4,-5.8; 13 -3.2,-5.8; 14 -2.4,-5.8; 15 -1.6,-5.8; 16 -0.8,-5.8; 17 0,-5.8; 18 0.8,-5.8; 19 1.6,-5.8; 20 2.4,-5.8; 21 3.2,-5.8; 22 4,-5.8; 34 4,5.8; 35 3.2,5.8; 36 2.4,5.8; 37 1.6,5.8; 38 0.8,5.8; 39 0,5.8; 40 -0.8,5.8; 41 -1.6,5.8; 42 -2.4,5.8; 43 -3.2,5.8; 44 -4,5.8
USB-B-MICRO-SMD_V03 = smd 1.4 x 0.4: D+1 2.7,0; D-1 2.7,0.65; GND1 2.7,-1.3; ID1 2.7,-0.65; VBUS1 2.7,1.3 | smd 1.5 x 1.8: SHIELD1 0,3.7; SHIELD2 0,-3.7 | smd 1.5 x 2.5: SHIELD3 0,0
JP1Y = drill 0.9 pad 1.676: 1 0,-1.27; 2 0,1.27
G5LE = drill 1.321 long: 1 -7.493,-5.969; 2 -7.493,5.969; COM -9.525,0; NC 4.699,5.969; NO 4.699,-5.969
P-LCC-2 = smd 4 x 4: A 0,2.75; C 0,-2.75
SM49 = smd 5.08 x 1.778: 1 -4.826,0; 2 4.826,0
SOT23-BEC = smd 1 x 1.4: B -0.95,-1.1; C 0,1.1; E 0.95,-1.1
R0603 = smd 1 x 1.1: 1 -0.85,0; 2 0.85,0
R1206 = smd 1.6 x 1.803: 1 -1.422,0; 2 1.422,0
TACTILE-PTH = drill 1.016 pad 1.88: 1 -3.251,2.261; 2 3.251,2.261; 3 -3.251,-2.261; 4 3.251,-2.261
B1,27 = smd 1.27 x 1.27: TP 0,0
TP-063 = drill 1.6 pad 3.048: 1 0,0
TP-063' = drill 3.2 pad 5: 1 0,0
SO08 = smd 0.6 x 2.2: 1 -1.905,-2.6; 2 -0.635,-2.6; 3 0.635,-2.6; 4 1.905,-2.6; 5 1.905,2.6; 6 0.635,2.6; 7 -0.635,2.6; 8 -1.905,2.6
TO127P254X495-3P = drill 0.991: 1 -2.54,-2.54 | drill 0.991 square: 2 -1.27,0; 3 0,-2.54
VIBE-MOTOR-10MM = drill 0.8 pad 1.676: + -5,-3.9; - -6.35,-2.54

### Placement (x,y rotation side)
C101  22.41,53.34 135 top
C102  37.38,60.08 180 top
C103  33.32,60.17 0 top
C104  6.35,48.26 180 top
C105  21.05,51.92 135 top
C106  38.1,17.46 0 bottom
C107  36.42,48.17 90 top
C108  31.39,27.75 270 top
C109  23.02,48.1 45 top
C110  69.53,71.12 180 top
C111  60.33,74.61 180 top
C112  25.59,33.66 225 top
C113  49.85,70.8 180 top
C201  61.59,52.07 90 top
C202  12.7,53.02 90 top
C203  21.27,8.26 270 top
C204  57.78,23.18 0 top
C205  12.7,63.18 90 top
C301  24.13,17.78 0 bottom
C302  48.26,26.35 270 bottom
C303  29.53,12.7 270 bottom
C304  57.47,42.55 180 bottom
C305  53.34,31.43 180 bottom
C306  25.08,19.68 0 bottom
C307  38.96,36.16 135 top
C308  46.35,27.3 270 bottom
C309  52.39,47.62 90 bottom
C310  43.66,36.75 315 top
C311  56.52,40.64 180 bottom
C312  43.81,40.01 180 top
C401  66.04,67.63 90 top
C402  46.04,45.22 45 top
C403  56.83,71.12 90 top
C404  41.46,45.59 45 top
C405  45.72,67.63 90 top
C406  39.48,49.48 45 top
C501  27.94,63.5 0 top
C502  22.86,63.5 0 top
D101  8.89,39.05 180 top
D102  44.45,17.46 0 bottom
D103  8.89,43.81 0 top
D104  25.08,26.67 180 top
D201  5.71,65.41 0 top
D202  5.71,55.24 0 top
D501  33.52,72.13 225 top
D502  16.96,71.57 315 top
F201  65.72,43.81 270 top
F202  10.48,12.06 90 top
F203  52.7,12.7 180 top
IC101  30.57,40.97 45 top
JP101  2.54,41.27 0 top
JP201  40.32,7.62 180 top
JP202  44.77,7.62 0 top
JP203  36.2,7.62 0 top
JP204  69.85,57.78 270 top
JP205  69.85,54.61 270 top
JP206  69.85,60.96 90 top
JP207  32.07,7.62 180 top
K101  10.79,27.94 0 bottom
LED201  56.55,57.56 315 top
LED202  36.2,13.65 270 top
LED203  57.78,33.02 0 top
LOGO101  10.48,73.34 0 top
Q101  35.44,56.58 180 top
Q102  34.72,27.66 270 top
Q201  9.84,53.02 90 top
Q202  9.84,63.18 90 top
Q501  27.94,66.36 0 top
Q502  22.86,66.36 0 top
R101  32.07,18.41 270 top
R102  13.02,40.32 0 top
R103  13.02,42.55 0 top
R104  35.56,52.09 180 top
R105  31.79,52.11 0 top
R106  9.84,48.26 180 top
R107  44.45,21.59 270 bottom
R108  21.91,49.21 45 top
R109  41.91,27.94 270 top
R110  20.32,37.6 0 top
R111  29.23,27.63 90 top
R201  64.45,60.96 0 top
R202  17.97,49.08 225 bottom
R203  14.92,63.18 90 top
R204  14.92,53.02 90 top
R205  16.19,47.49 45 bottom
R206  44.13,13.65 0 top
R207  64.86,34.89 315 top
R208  7.94,68.9 90 top
R209  4.13,60.33 0 top
R301  41.37,35.94 135 top
R302  45.99,36.68 315 top
R303  28.57,19.68 0 bottom
R304  45.72,41.59 180 top
R305  46.35,30.8 270 bottom
R306  53.02,40.64 180 bottom
R401  45.91,47.31 45 top
R402  41.78,47.89 45 top
R403  62.55,66.67 0 top
R404  39.24,51.57 45 top
R405  56.83,67.31 90 top
R406  45.72,63.5 90 top
R501  27.98,51.47 90 top
R502  27.94,61.91 180 top
R503  25.88,51.45 90 top
R504  22.86,61.91 180 top
S101  38.1,21.91 180 top
TP1  35.56,33.34 0 top
TP2  41.91,31.11 0 top
TP3  38.73,32.07 0 top
TP4  45.72,17.14 0 top
TP5  33.97,17.14 0 top
TP6  2.86,13.97 270 top
TP7  2.86,7.62 270 top
TP8  73.34,43.81 0 top
TP9  73.34,49.53 0 top
TP10  TP-063  [TP-063']  52.7,4.13 0 top
TP11  TP-063  [TP-063']  63.18,4.13 0 top
TP12  68.26,29.53 0 top
TP13  68.26,23.18 0 top
TP14  6.03,17.78 0 top
TP15  14.61,17.78 0 top
U301  25.4,12.7 0 bottom
U302  53.34,27.62 270 bottom
U303  56.2,47.62 180 bottom
U401  68.34,66.41 180 top
U402  59.05,70.17 180 top
U403  48.58,66.36 180 top
U$501  36.83,72.71 0 top
U$502  16.51,74.93 90 top

### Tracks (layer width: path | path; a pad name or v marks a point on that pad's centre or on a via)
444  (via drill 0.3)
  Top 2: F203.2 52.7,19.84 | 52.7,19.84 v52.7,19.88 | 52.7,19.84 56.04,23.18
  Bottom 0.4: U302.3 U302.4
  Bottom 2: U302.4 56.01,25.65 C204.+ v52.7,19.88
  other vias: 53.02,20.64 53.98,20.64 53.98,21.59 54.93,21.59
  pour Top (no thermals): 49.53,15.88 51.12,14.29 54.61,14.29 56.2,15.88 56.2,21.59 57.15,22.54 57.15,23.81 56.52,24.45 50.16,24.45 49.53,23.81
  pour Bottom (no thermals): 57.47,27.3 54.61,27.3 54.61,25.08 53.98,24.45 50.16,24.45 49.53,23.81 49.53,15.88 51.12,14.29 54.61,14.29 56.2,15.88 56.2,21.59 57.47,22.86
+6V
  Top 1: R207.2 65.87,33.83 68.26,31.43 TP12.1
  Bottom 0.4: U302.2 55.94,28.89 U302.1
  Bottom 2: TP12.1 56.58,29.53 55.94,28.89
  pour Bottom (isolate 0.01, no thermals): 54.61,27.94 59.37,27.94 60.33,26.99 74.93,26.99 76.2,28.26 76.2,33.34 74.93,34.61 57.15,34.61 56.2,33.66 56.2,31.11 55.24,30.16 54.61,30.16
  pour Top (no thermals): 66.04,34.61 74.93,34.61 76.2,33.34 76.2,28.26 74.93,26.99 65.41,26.99 64.45,27.94 64.45,33.02
+12V  (via drill 0.3)
  Top 0.2: 17.99,72.35 D502.3
  Top 0.4: 17.99,72.35 U$502.+ | D501.3 34.3,71.28 U$501.+
  Top 0.5: D104.3 25.86,25.57 26.04,25.4 v26.04,24.13
  Top 0.7: 30.48,75.25 33.97,75.25
  Top 0.8: K101.1 22.61,21.97 25.08,24.45 D104.3 | 34.3,71.28 34.45,71.28 v36.83,68.9 | D502.3 18.73,73.34 28.57,73.34 30.48,75.25 | 33.97,75.25 35.56,73.66 35.56,72.61 D501.3
  Top 1: JP205.1 JP204.1 JP206.2 R201.2
  Bottom 0.5: U303.2 55.19,50.23 54.93,50.48 54.93,55.88 56.83,57.78 JP204.1 | v26.04,24.13 27.94,24.13 42.86,39.05 42.86,53.98 47.31,58.42
  Bottom 0.8: v36.83,68.9 47.31,58.42 54.29,51.44 54.29,51.12 | 54.29,51.12 54.93,50.48 | U303.1 54.29,51.12
  pour Bottom (no thermals): 55.88,48.9 53.98,48.9 53.98,51.12 51.75,53.34 50.48,54.61 53.66,57.78 53.98,58.1 67.63,58.1 67.94,58.42 67.94,61.91 68.26,62.23 69.22,62.23 69.53,61.91 69.53,53.98 69.22,53.66 67.94,53.66 67.63,53.98 65.09,56.52 56.2,56.52 55.24,55.56 54.93,55.24 54.93,52.39 55.88,51.44
  pour Bottom (no thermals): 46.35,59.05 46.35,57.78 46.67,57.47 47.94,57.47
_+12V
  Top 1: F201.2 61.91,49.97 C201.+
  Bottom 0.2: U303.4 U303.3
  Bottom 1: C201.+ 58.17,50.29 U303.4
  pour Bottom: 56.52,48.9 59.05,48.9 59.69,48.26 59.69,42.55 60.64,41.59 64.14,41.59 65.09,42.55 65.09,48.26 61.91,51.44 61.59,51.75 56.52,51.75
  pour Top (no thermals): 56.52,51.75 61.59,51.75 65.09,48.26 65.09,42.55 64.14,41.59 60.64,41.59 59.69,42.55 59.69,48.26 59.05,48.9 56.52,48.9
_VCC
  Top 1: F202.2 19.24,12.06 C203.+
  Bottom 0.5: U301.3 U301.4
  Bottom 1: C203.+ 23.43,10.03 U301.4
  pour Top (no thermals): 12.38,13.65 12.38,10.48 13.34,9.53 20,9.53 20.32,9.21 22.54,9.21 22.54,14.29 13.34,14.29
  pour Bottom (no thermals): 13.34,14.29 12.38,13.65 12.38,10.48 13.34,9.53 20,9.53 20.95,8.57 24.77,8.57 25.08,8.89 25.08,11.43 22.54,11.43 22.54,14.29
AN_6V
  Bottom 0.3: U302.7 46.4,28.26 C308.1 R305.2
AN_6V_  (via drill 0.3)
  Top 0.35: IC101.21 37.97,38.1 42.23,38.1 42.96,37.37 C310.1 43.45,37.78 44.77,37.78 45.26,37.29 R302.1 46.35,38.25 v46.35,38.42
  Bottom 0.35: R305.1 v46.35,38.42
AN_12V
  Bottom 0.3: U303.7 55.56,40.69 C311.1 R306.2
AN_12V_  (via drill 0.3)
  Top 0.35: v47.94,41.59 R304.1
  Top 0.4: IC101.22 38.15,39.05 43.81,39.05 44.69,39.93 C312.1 45.72,40.01 46.57,40.85 R304.1
  Bottom 0.35: R306.1 48.9,40.64 v47.94,41.59
AN_VCC
  Bottom 0.3: R303.2 C306.1 26.04,19.64 U301.7
AN_VCC_  (via drill 0.3)
  Top 0.35: IC101.19 38.27,35.54 C307.1 40.19,34.92 41.59,34.92 | R301.1 41.97,35.3 41.59,34.92 | 40.96,34.33 41,34.33 41.59,34.92
  Top 0.5: v40.96,34.29 40.96,34.33
  Bottom 0.5: R303.1 29.43,22.76 v40.96,34.29
COOLERS
  Top 0.4: R503.1 27.95,50.6 | 27.95,50.6 R501.1 | 27.95,50.6 27.95,49.54 27.3,48.9 27.3,47.64 IC101.36
D+
  Top 0.35: IC101.43 24.18,42.81 23.18,43.81 21.91,43.81 18.41,40.32 R102.2
D-
  Top 0.35: IC101.42 23.5,44.65 21.15,44.65 19.05,42.55 R103.2
GND  (via drill 0.3)
  Top 0.2: 13.02,39.37 13.02,41.27 | 31.75,53.66 31.75,50.01 | 24.13,66.36 23.81,66.04 Q502.E 23.73,65.18
  Top 0.3: D103.2 9.84,42.55 10.79,41.59 12.7,41.59 13.02,41.27 | 13.02,39.37 12.7,39.05 8.26,39.05 7.94,39.37 D101.2 7.76,39.98 JP101.GND1 2.89,39.98 2.54,40.32 | JP101.SHIELD1 JP101.SHIELD3 2.54,40.32 | JP101.SHIELD2 2.54,40.32
  Top 0.35: C112.2 24.98,35.38 IC101.6 26.47,36.95 28.26,38.73 27.62,38.73 v30.48,40.96 v27.94,40.96 v25.4,40.96 v30.48,46.04 26.71,42.27 27.62,42.27 | Q102.E 31.56,26.71 C108.2 | IC101.29 34.05,45.64 31.83,43.42 | 31.83,43.42 30.68,42.27 27.62,42.27 | IC101.23 37.48,42.25 36.2,40.96 | IC101.26 35.77,43.94 33.22,41.4 33.22,41.39 v33.66,40.96 33.97,40.96 | 33.97,40.96 34.92,40.96 | C109.2 23.96,48.72 IC101.38 27.07,45.64 29.21,43.5 28.85,43.5 27.62,42.27 | 31.75,50.01 30.64,48.9 30.64,44.61 31.83,43.42 | 33.97,40.96 IC101.20 38.16,36.77 C307.2 40.54,36.77 R301.2 42.2,36.54 42.86,35.88 44.02,35.88 C310.2 44.85,35.56 46.04,35.56 46.56,36.08 R302.2 | v29.53,10.16 29.53,6.48 | 13.02,41.27 v15.24,41.27 | 31.75,53.66 32.38,54.29 34.69,54.29 35.4,55.01 35.4,58.97 | 35.4,58.97 C102.2 | 35.4,58.97 35.4,58.98 35.39,58.98 C103.2
  Top 0.4: C107.2 36.32,49.02 35.24,47.94 35.24,46.77 IC101.29 | C101.2 21.81,53.89 C105.2 20.45,52.51 20,52.07 20,51.12 21.27,49.85 22.48,49.85 R108.2 22.54,49.81 C109.2 | R204.2 C202.2 11.04,53.87 Q201.E | R203.2 C205.2 11.04,64.03 Q202.E | R504.1 23.71,63.48 C502.2 23.73,65.18 | R502.1 28.79,63.48 C501.2 28.82,65.18 Q501.E 28.89,66.04 28.57,66.36 24.13,66.36 | 34.92,40.96 v35.88,40.96 36.2,40.96 38.73,40.96 39.69,40.01 C312.2 42.86,40.08 42.86,40.96 43.5,41.59 R304.2 | C404.2 42.38,46.51 R402.2 40.35,48.49 | 40.35,48.49 IC101.26 | R404.2 39.91,52.17 40.32,51.75 40.32,50.32 C406.2 40.35,49.84 40.35,48.49 | 32.07,15.03 32.07,13.65 | IC101.23 37.8,42.55 43.81,42.55 44.45,43.18 45.72,43.18 46.99,44.45 46.99,45.4 46.66,45.74 C402.2 46.99,46.17 46.99,47.31 46.51,47.79 R401.2
  Top 0.5: v22.54,40.96 v25.4,40.96 | C401.2 68.02,68.63 U401.3 68.53,69.14 C110.2 v66.04,71.12 | C403.2 58.47,72.12 U402.3 59.05,74.34 C111.2 v57.47,74.61 | C405.2 48.31,68.63 U403.3 48.9,68.9 48.9,70.75 C113.2 48.85,72.34 v48.9,72.39 | R502.1 36.51,61.91 38.1,63.5 | 38.1,63.5 v41.59,66.99 | v27.78,26.79 v27.79,26.78 R111.1 arc-90 29.33,26.88 C108.2 | v33.02,31.11 36.2,31.11 v37.78,29.53 | v35.24,17.46 34.29,17.46 TP5.TP | R204.2 17.68,53.87 18.41,54.61 18.41,63.61 18,64.03 | R203.2 18,64.03 | 18,64.03 18.41,64.45 v18.41,65.09 | C104.2 3.17,48.26 2.54,47.62 JP101.SHIELD1 | v37.47,64.14 38.1,63.5
  Top 0.8: C203.- v9.29,6.48 v9.29,6.47 | 31.94,6.48 JP207.2 | v46.04,52.07 46.04,53.34 46.67,53.98 46.67,56.52 v51.12,60.96 v51.75,61.59 v52.39,62.23 v53.02,62.87 v53.66,63.5 | 32.07,13.65 32.07,12.7 v29.53,10.16
  Top 1: TP5.TP 33.97,14.18 LED202.C 32.07,15.03 R101.2 | JP202.1 JP201.2 JP203.1 JP207.2 | v31.75,21.91 28.57,21.91 25.72,19.05 25.72,9.53 23.81,7.62 22.23,7.62 21.27,6.67 C203.- | JP206.1 JP204.2 JP205.2 | TP9.1 73.34,52.39 JP205.2 | JP205.2 71.12,53.02 70.17,52.07 63.82,52.07 62.04,53.85 C201.- 56.38,53.85 LED201.C | v45.09,51.12 v46.04,52.07 | TP7.1 20.13,7.62 C203.- | C203.- 29.53,6.48 31.94,6.48
  Bottom 0.3: C308.2 47.16,25.5 C302.2 48.48,25.72 U302.5 52.7,25.72 53.34,26.35 53.34,29.84 54.29,30.8 C305.2 | C311.2 58.32,41.44 C304.2 58.1,42.76 U303.5 58.1,46.99 57.15,47.94 53.98,47.94 53.34,48.58 | C306.2 23.28,18.88 C301.2 23.5,17.57 U301.5 23.5,13.02 24.13,12.38 27.62,12.38 28.25,11.75 C303.2
  Bottom 0.35: C309.2 53.34,48.58 | v15.24,41.27 15.24,39.69 16.51,38.42
  Bottom 0.4: C303.2 v29.53,10.16
  Bottom 0.5: v48.9,72.39 51.75,72.39 52.39,71.75 | 52.39,71.75 53.66,70.48 v53.66,63.5 | v57.47,74.61 55.24,74.61 52.39,71.75 | v66.04,71.12 65.41,71.12 64.45,70.17 64.45,63.82 64.77,63.5 | v41.59,66.99 44.13,66.99 47.94,63.18 51.44,63.18 v52.39,62.23 | C309.2 48.58,48.58 45.56,51.59 | v27.78,26.79 27.78,27.46 28.26,27.94 29.84,27.94 v33.02,31.11 | v37.78,29.53 38.89,28.42 | C106.2 v35.24,17.46 | C308.2 38.37,26.3 38.1,26.04 | v18.41,65.09 36.51,65.09 v37.47,64.14
  Bottom 0.8: v9.29,6.47 9.29,31.19 16.51,38.42 19.05,40.96 v22.54,40.96 | JP206.1 71.12,62.55 70.17,63.5 64.77,63.5 v53.66,63.5 v53.02,62.87 v52.39,62.23 v51.75,61.59 v51.12,60.96
  Bottom 1: v31.75,21.91 37.47,21.91 38.1,22.54 38.1,26.04 38.1,27.62 38.89,28.42 44.13,33.66 44.13,38.73 45.09,39.69 v45.09,51.12 45.56,51.59 v46.04,52.07
  other vias: 30.48,43.5 30.48,38.42 30.8,35.88
  pour Top: 30.48,46.99 30.8,46.99 36.51,41.27 36.51,40.64 30.8,34.92 30.48,34.92 24.77,40.64 24.77,41.27
  pour Bottom (no thermals): 30.48,46.99 30.8,46.99 36.51,41.27 36.51,40.64 30.8,34.92 30.48,34.92 24.77,40.64 24.77,41.27
  pour Top (no thermals): 1.27,9.53 3.81,9.53 4.76,8.57 20.32,8.57 20.64,8.26 21.59,8.26 21.91,8.57 28.26,8.57 29.53,7.3 46.04,7.3 46.67,6.67 46.67,0 1.27,0 0.95,0.32 0.95,9.21
  pour Top (isolate 0.5, no thermals): 0.32,49.53 17.14,49.53 17.14,36.51 0.32,36.51
  pour Top (isolate 0.5, no thermals): 26.99,61.28 42.55,61.28 43.81,60.01 43.81,55.24 42.23,53.66 39.37,53.66 37.47,51.75 36.2,50.48 30.16,50.48 29.21,51.44 29.21,53.66 26.99,55.88
  pour Top (no thermals): 75.88,47.31 68.9,47.31 65.09,51.12 64.14,51.12 62.23,53.02 56.83,53.02 55.88,53.02 55.56,53.34 55.56,54.61 56.83,55.88 62.23,55.88 64.45,53.66 65.09,53.02 69.85,53.02 70.17,53.34 70.17,61.91 70.48,62.23 76.2,62.23 76.2,47.31
  pour Bottom (isolate 1): 0,78.11 76.83,78.11 76.83,63.18 32.07,63.18 26.04,57.15 26.04,47.94 20.95,42.86 17.78,42.86 13.65,46.99 10.16,50.48 0,50.48
  pour Top (isolate 1): 0,78.11 76.83,78.11 76.83,63.18 32.07,63.18 26.04,57.15 26.04,47.94 20.95,42.86 17.78,42.86 10.16,50.48 0,50.48
  pour Bottom (isolate 1): 0,16.83 4.02,16.83 arc-45 4.2,16.75 5.08,15.88 26.88,15.88 arc-45 27.06,15.8 32.07,10.79 47.2,10.79 arc45 47.38,10.87 48.58,12.06 48.58,29.1 arc-45 48.65,29.28 54.61,35.24 54.61,47.2 arc45 54.54,47.38 51.75,50.16 51.75,52.28 arc45 51.68,52.46 50.16,53.98 49.53,54.61 57.15,62.23 43.81,62.23 43.81,61.38 arc45 43.89,61.2 45.09,60.01 45.09,55.35 arc-45 45.01,55.17 42.86,53.02 42.23,52.39 38.84,52.39 arc45 38.66,52.31 35.24,48.9 35.24,47.41 arc45 35.32,47.23 37.78,44.77 41.91,40.64 33.02,31.75 27.41,31.75 arc-45 27.23,31.82 23.5,35.56 0,35.56
  pour Top (isolate 1): 0,16.83 4.02,16.83 arc-45 4.2,16.75 5.08,15.88 26.88,15.88 arc-45 27.06,15.8 32.07,10.79 47.2,10.79 arc45 47.38,10.87 48.58,12.06 48.58,29.1 arc-45 48.65,29.28 54.61,35.24 54.61,47.2 arc45 54.54,47.38 51.75,50.16 51.75,52.28 arc45 51.68,52.46 49.53,54.61 57.15,62.23 43.81,62.23 43.81,61.38 arc45 43.89,61.2 45.09,60.01 45.09,55.35 arc-45 45.01,55.17 42.23,52.39 38.84,52.39 arc45 38.66,52.31 35.24,48.9 35.24,47.41 arc45 35.32,47.23 41.91,40.64 33.02,31.75 27.41,31.75 arc-45 27.23,31.82 23.5,35.56 0,35.56
  pour Bottom (isolate 0.5, rank 6): 76.83,0 76.83,78.11 0,78.11 0,0
  pour Top (isolate 0.5, rank 6): 76.83,0 76.83,78.11 0,78.11 0,0
GND1
  Top 1: LED203.C 57.78,27.3 61.28,23.81 61.28,23.18
  Top 2: TP13.1 61.28,23.18 C204.-
  pour Top (isolate 1.27, no thermals): 60.33,26.04 59.05,25.08 59.05,1.27 76.2,1.27 76.2,25.08 74.93,26.04
  pour Bottom (no thermals): 60.01,26.04 74.93,26.04 76.2,25.08 76.2,1.27 59.05,1.27 59.05,25.08
MCLR
  Top 0.35: IC101.18 41.56,31.11 TP2.TP R109.1
N$1
  Top 1: R206.1 LED202.A
N$2
  Bottom 0.3: U302.6 48.48,26.99 C302.1
N$3
  Top 0.35: C103.1 32.45,58.41 Q101.2
  Top 0.4: R105.1 30.94,56.25 Q101.2
N$4
  Top 1: R201.1 59.95,60.96 LED201.A
N$5
  Top 1: TP8.1 F201.1
  pour Top (no thermals): 75.88,46.35 75.88,42.23 75.25,41.59 67.63,41.59 66.99,42.23 66.99,45.72 67.63,46.35
  pour Bottom (no thermals): 75.88,46.35 75.88,42.23 75.25,41.59 67.63,41.59 66.99,42.23 66.99,45.4 66.99,45.72 67.63,46.35
N$6
  Bottom 0.3: U303.6 56.83,42.76 C304.1
N$7
  Top 1: R207.1 63.8,35.89 62.87,36.83 58.84,36.83 LED203.A
N$8
  Top 2: TP10.1 F203.1
  pour Top (no thermals): 51.12,11.11 54.61,11.11 56.2,9.53 56.2,1.27 55.24,0.32 50.48,0.32 49.53,1.27 49.53,9.53
  pour Bottom (no thermals): 51.12,11.11 54.61,11.11 56.2,9.53 56.2,1.27 55.88,0.95 49.85,0.95 49.53,1.27 49.53,9.53
N$9
  Top 0.8: R208.1 5.84,67.47 D201.A
N$10
  Top 0.4: D202.A 5.71,60.16 R209.2
N$11
  Bottom 0.4: D102.3 R107.2
N$12
  Bottom 0.3: U301.6 24.77,17.57 C301.1
N$13  (via drill 0.3)
  Top 0.4: R203.1 C205.1 11.04,62.33 Q202.B
  Top 0.5: v14.92,60.33 R203.1
  Bottom 0.4: R202.1 17.31,49.68 16.83,50.16 16.83,58.42 v14.92,60.33
N$14
  Top 0.4: R501.2 27.98,53.94 26.99,54.93 26.99,61.81 R502.2 27.09,63.48 C501.1 26.99,63.58 Q501.B
N$15  (via drill 0.3)
  Top 0.4: v14.92,49.85 R204.1 C202.1 11.04,52.17 Q201.B
  Bottom 0.4: R205.2 15.59,48.54 14.92,49.21 v14.92,49.85
N$21
  Top 0.4: Q501.C 27.94,68.9 29.21,70.17 U$501.- 30.48,73.03 31.75,74.3 32.7,74.3 D501.1
N$28
  Top 0.35: Q102.C 35.82,26.62 34.92,25.72 27.3,25.72 26.04,26.99 D104.1
  Top 0.8: D104.1 26.03,28.58 20.64,33.97 18.35,33.97 K101.2
N$29
  Top 0.35: R110.1 19.47,36.73 27.62,28.57 29.14,28.57 R111.2 31.25,28.48 C108.1 33.6,28.63 Q102.B
N$30
  Top 0.4: Q202.C 5.74,63.18 D201.C
N$31
  Top 0.4: Q201.C 5.74,53.02 D202.C
N$33
  Top 0.25: 11.75,43.81 8.26,43.81 7.94,43.5
  Top 0.3: JP101.D-1 7.15,41.92 D103.1 7.94,43.5 | R103.1 12.17,43.4 11.75,43.81
N$37
  Top 0.3: JP101.D+1 8.72,41.27 D101.1 12,40.15 R102.1
N$45
  Top 0.4: R101.1 34.47,19.27 S101.2 S101.1
N$46
  Top 2: 2.86,13.34 4.13,12.06 F202.1
  pour Top (no thermals): 0.95,15.88 3.81,15.88 5.71,13.97 8.26,13.97 8.89,13.34 8.89,10.79 8.26,10.16 3.81,10.16 0.95,13.02
N$70
  Top 0.4: R503.2 25.88,56.03 21.91,60.01 21.91,61.81 R504.2 21.98,61.94 C502.1 21.91,63.58 Q502.B
N$71
  Top 0.4: Q502.C 20.17,67.46 U$502.-
  Top 0.5: D502.1 15.51,71.39 14.92,70.8 14.92,69.53 16.19,68.26 18.73,68.26 U$502.-
OSC1
  Top 0.35: Q101.1 40.32,56.52 40.32,55.24 37.17,52.09 R104.1
  Top 0.4: C102.1 38.25,58.58 Q101.1 | IC101.30 34.53,47.19 34.53,49.21 36.39,51.08 36.39,52.08 R104.1
OSC2
  Top 0.4: R105.2 34.69,52.11 R104.2 34.69,52.07 34.69,51.08 33.66,50.05 33.66,47.47 32.98,46.79 IC101.31
PGC
  Top 0.35: TP1.TP 35.56,34.85 IC101.16
PGD
  Top 0.35: IC101.17 38.73,32.81 TP3.TP
SD
  Top 0.35: IC101.2 22.67,37.6 R110.2
TS1
  Top 0.5: U401.2 69.39,66.63 C401.1 65.99,66.67 R403.2
TS1_
  Top 0.35: R403.1 60.96,66.67 50.16,55.88 49.85,55.56
  Top 0.4: IC101.24 37.62,43.5 43.5,43.5 44.6,44.6 C402.1 45.09,44.93 45.09,46.35 45.3,46.58 R401.1 45.05,46.71 44.77,46.99 44.77,47.62 49.21,52.07 49.21,54.93 50.16,55.88
TS2
  Top 0.5: U402.2 60.28,70.12 C403.1 R405.2
TS2_
  Top 0.35: C404.1 41.05,44.77 42.55,44.77 43.5,45.72 43.5,47.62 47.62,51.75 47.62,54.61 56.83,63.82 R405.1
  Top 0.4: IC101.25 37.96,44.97 C404.1 40.32,45.49 40.32,46.35 41.18,47.21 R402.1
TS3
  Top 0.5: U403.2 45.99,66.36 C405.1 R406.2
TS3_
  Top 0.35: R406.1 45.72,54.61 44.45,53.34 39.69,53.34 38.42,52.07 38.42,51.19 R404.1 38.58,50.97 38.1,50.48 38.1,49.62 C406.1
  Top 0.4: C406.1 38.86,48.13 IC101.27
U_MCLR
  Top 0.4: S101.4 S101.3 41.91,24.73 R109.2
  Bottom 0.4: R107.1 43.18,22.44 | 43.18,22.44 43.08,22.44 S101.3 | C106.1 41.91,17.46 42.86,18.41 42.86,22.12 43.18,22.44
USB_IN
  Top 0.4: 24.06,47.48 C109.1 21.31,48.58 R108.1 20.95,48.26 R106.1
  Top 0.406: 24.06,47.48 IC101.39
USBCON  (via drill 0.3)
  Top 0.4: v18.41,45.4 23.88,45.4 IC101.41
  Bottom 0.4: R205.1 16.93,46.89 v18.41,45.4
USBTXRX  (via drill 0.3)
  Top 0.4: v20.64,46.35 24.06,46.35 IC101.40
  Bottom 0.4: R202.2 18.57,48.42 v20.64,46.35
VCC  (via drill 0.3)
  Top 0.35: C112.1 26.19,35.46 IC101.7
  Top 0.4: C107.1 36.42,46.82 IC101.28
  Top 0.5: v37.78,48.26 36.83,47.31 36.43,47.31 C107.1 | U401.1 70.88,70.77 C110.1 | U402.1 61.59,74.34 C111.1 | TP4.TP 45.72,28.57 50.48,33.34 | 50.48,33.34 v52.39,33.34 | v50.8,46.67 50.8,33.66 50.48,33.34 | U403.1 51.12,70.53 C113.1
  Top 0.8: C112.1 27.62,32.82 v27.62,32.07 | C113.1 50.85,74.56 | 50.85,74.56 48.9,76.52 10.79,76.52 7.94,73.66 R208.2 7.79,70.17 4.76,70.17 2.71,68.11 R209.1 | 50.85,74.56 51.07,74.56 53.02,76.52 60.64,76.52 61.59,75.56 | 61.59,75.56 61.59,74.88 C111.1 | C110.1 70.53,74.88 68.9,76.52 62.55,76.52 61.59,75.56
  Top 1: TP4.TP 45.72,13.82 R206.2 45.72,13.49 45.72,11.75 44.77,10.79 JP202.2 JP201.1 JP203.2 JP207.1 | v14.29,31.11 v9.84,35.56 | R209.1 v2.71,55.89 v2.7,55.88
  Bottom 0.3: C305.1 51.44,31.43 50.8,30.8 50.8,29.59 U302.8 | C309.1 52.39,45.72 53.02,45.09 54.23,45.09 U303.8 | C303.1 29.53,14.92 29.21,15.24 27.36,15.24 U301.8
  Bottom 0.35: C303.1 34.61,13.65 36.2,12.06 JP203.2
  Bottom 0.406: U301.2 26.67,10.1
  Bottom 0.5: v52.39,33.34 C305.1 | C309.1 52.07,46.67 v50.8,46.67 | D102.1 45.4,9.63 arc-45 45.33,9.45 JP202.2
  Bottom 0.8: 15.24,30.16 27.62,30.16 | 27.62,30.16 30.48,30.16 41.27,40.96 41.27,44.77 v37.78,48.26 | v27.62,32.07 27.62,30.16 | JP207.1 28.89,8.89 27.68,10.1 U301.1 26.67,10.1
  Bottom 1: 15.24,30.16 15.08,30.32 | 15.08,30.32 v14.29,31.11 | v2.7,55.88 2.7,42.7 v9.84,35.56 | 15.08,30.32 11.11,26.35 11.11,4.13 12.38,2.86 13.02,2.86
  Bottom 1.2: 26.67,10.1 26.67,4.45 25.08,2.86 13.02,2.86
  pour Bottom (no thermals): 25.72,8.89 25.72,11.43 27.94,11.43 27.94,10.48 28.89,9.53 46.67,9.53 46.99,9.21 46.99,8.26 46.67,7.94 25.72,7.94
VUSB
  Top 0.4: JP101.VBUS1 5.75,42.58 7.35,44.18 C104.1 R106.2
VUSB_
  Top 0.4: C101.1 23.01,52.55 | 23.01,52.55 24.45,51.12 24.45,49.36 IC101.37 | 23.01,52.55 22.88,52.55 C105.1
WG1
  Top 2: K101.COM 16.19,27.94 14.61,26.35 TP15.1
WG2
  Top 2: K101.NC 6.1,28.64 2.22,24.77 2.22,19.37 3.81,17.78 TP14.1

### Text on the board
Bottom: DIDV_-_Controle_Corrente_Total | Rev. 10